# Altium project NANORACK_LASER.PrjPcb
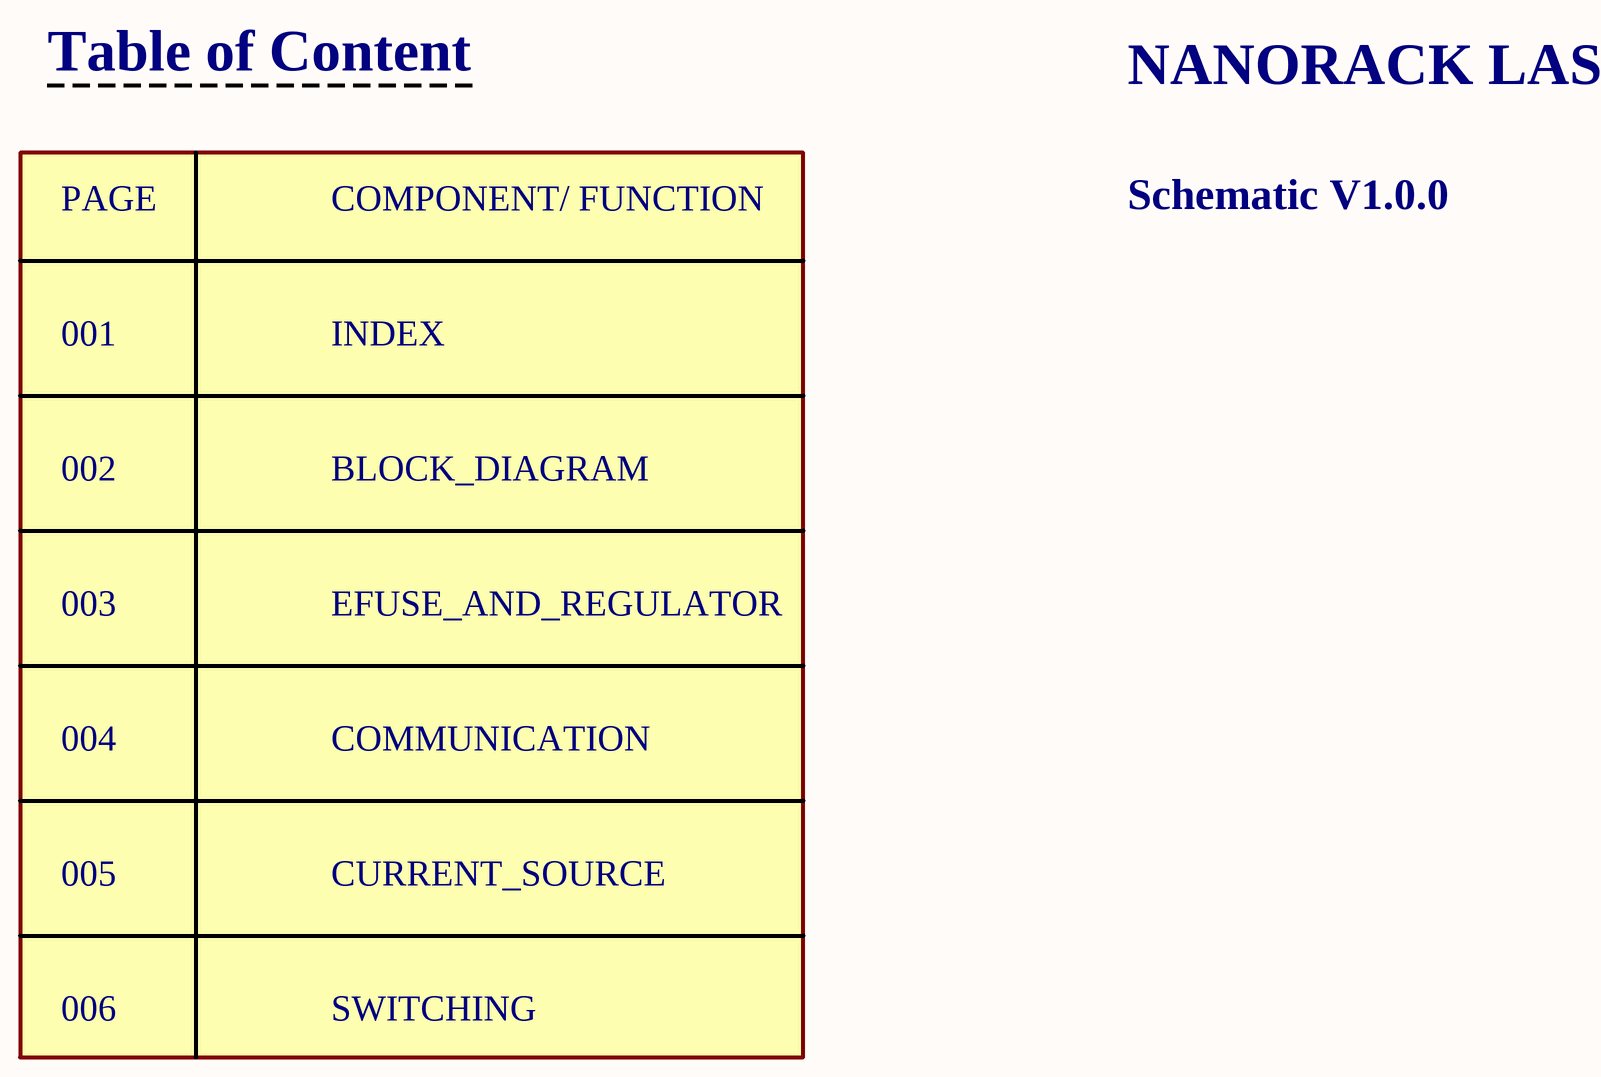
[diagram p0: INDEX.SchDoc]
7 sheets, 598 parts. Net scope: global (net labels, ports and power ports of the same name join across sheets).
Board file: LASERDIODE_FIX.PcbDoc
Sheets:
  INDEX.SchDoc
  BLOCK_DIAGRAM.SchDoc
  EFUSE_AND_REGULATOR.SchDoc
  COMMUNICATION.SchDoc
  CURRENT_SOURCE.SchDoc
  SWITCHING.SchDoc
  SWITCHING (CONT).SchDoc

## Sheet INDEX.SchDoc
size 420 x 297 mm; SheetNumber: 1; SheetTotal: 6

### Notes on the sheet
- Table of Content
- NANORACK LASER
- PAGE
- COMPONENT/ FUNCTION
- Schematic V1.0.0
- 001
- INDEX
- 002
- BLOCK_DIAGRAM
- 003
- EFUSE_AND_REGULATOR
- 004
- COMMUNICATION
- 005
- CURRENT_SOURCE
- 006
- SWITCHING
- Project:
- BEE-PC1
- Sub-system:
- Design by:
- Hung Nguyen D.
- Bao Bui Q.
- Sheet title:
- Sheet
- A3
- of
- Checked by:
- Approved by:
- Vu Pham
- Revision:
- Document No:
- V1.0.0
- Size:
- Date:

## Sheet BLOCK_DIAGRAM.SchDoc
size 420 x 297 mm; SheetNumber: 2; SheetTotal: 6

### Notes on the sheet
- Project:
- BEE-PC1
- Sub-system:
- Design by:
- Hung Nguyen D.
- Bao Bui Q.
- Sheet title:
- Sheet
- A3
- of
- Checked by:
- Approved by:
- Vu Pham
- Revision:
- Document No:
- V1.0.0
- Size:
- Date:
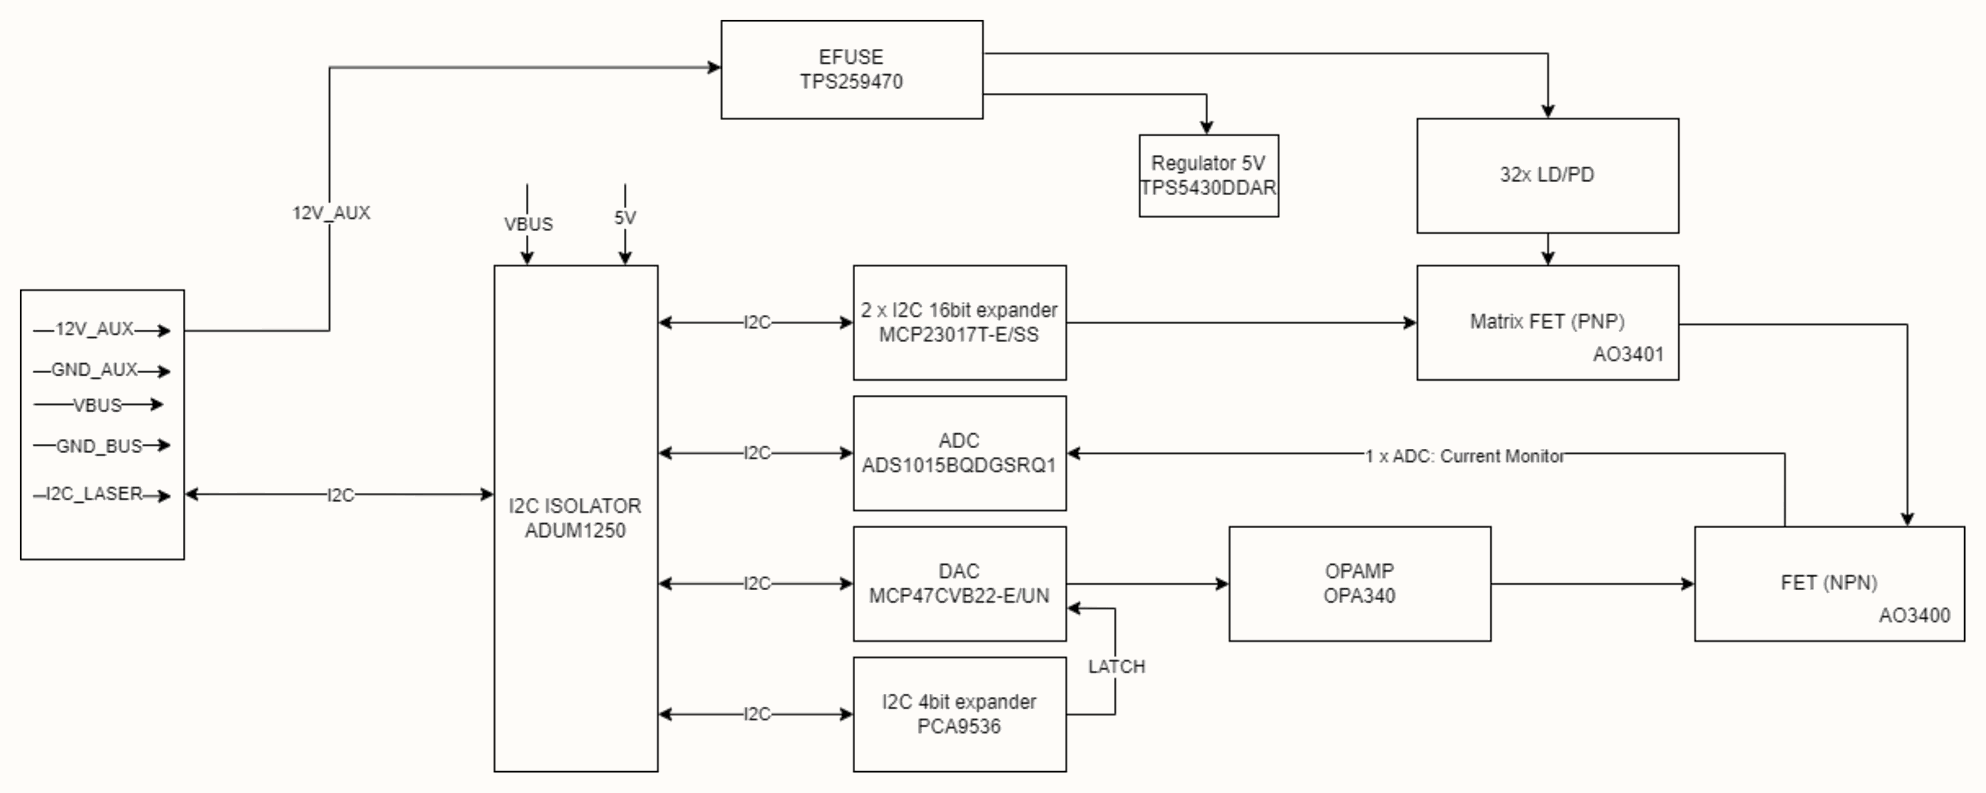
[diagram p1: BLOCK_DIAGRAM.SchDoc]

## Sheet EFUSE_AND_REGULATOR.SchDoc
size 420 x 297 mm; SheetNumber: 3; SheetTotal: 6
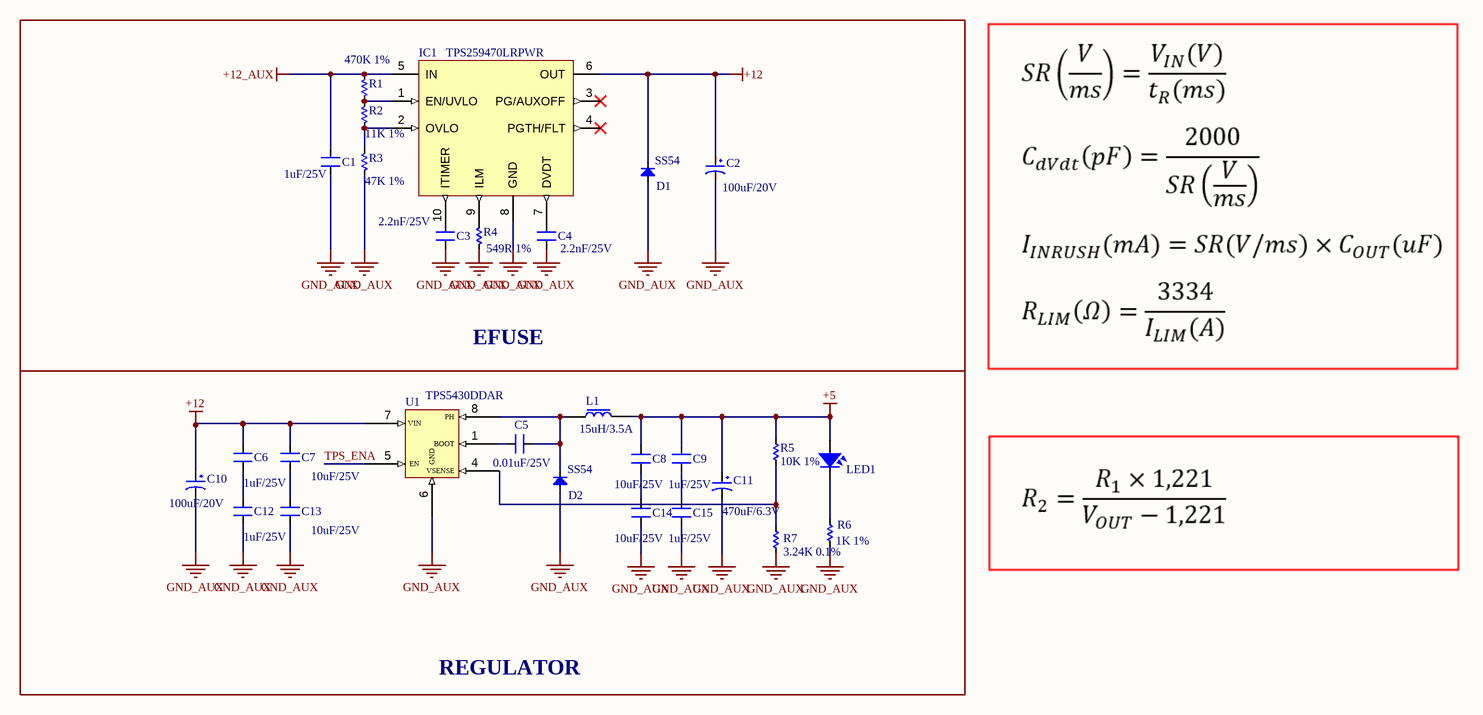
[diagram p2: EFUSE_AND_REGULATOR.SchDoc]

### Parts
C1  1uF/25V  [SM-0603]
C2  100uF/20V  [tu tantalum smd7343]
C3  2.2nF/25V  [SM-0603]
C4  2.2nF/25V  [SM-0603]
C5  0.01uF/25V  [SM-0603]
C6  1uF/25V  [SM-0603]
C7  10uF/25V  [SM-0603]
C8  10uF/25V  [SM-0603]
C9  1uF/25V  [SM-0603]
C10  100uF/20V  [tu tantalum smd7343]
C11  470uF/6.3V  [tu tantalum smd7343]
C12  1uF/25V  [SM-0603]
C13  10uF/25V  [SM-0603]
C14  10uF/25V  [SM-0603]
C15  1uF/25V  [SM-0603]
D1  SS54  [DIO-SMD-A]
D2  SS54  [DIO-SMD-A]
IC1  TPS259470LRPWR  [TPS259470]
L1  15uH/3.5A  [SRP7050TA]
LED1  LED  [REDLED_0603]  (value not drawn)
R1  470K 1%  [RES-SMD-0603]
R2  11K 1%  [RES-SMD-0603]
R3  47K 1%  [RES-SMD-0603]
R4  549R 1%  [RES-SMD-0603]
R5  10K 1%  [RES-SMD-0603]
R6  1K 1%  [RES-SMD-0603]
R7  3.24K 0.1%  [RES-SMD-0603]
U1  TPS5430DDAR  [HSOP8]

### Blocks framed on the sheet
EFUSE: C1-C4 D1 IC1 R1-R4
REGULATOR: C5-C15 D2 L1 LED1 R5-R7 U1

### Nets
+5: C8.1 C9.1 C11.1 L1.2 LED1.1 R5.2
+12: C2.1 C6.1 C7.1 C10.1 D1.2(K) IC1.6(OUT) U1.7(VIN)
+12_AUX: C1.2 IC1.5(IN) R1.2
GND_AUX: C1.1 C2.2 C3.1 C4.1 C10.2 C11.2 C12.2 C13.2 C14.2 C15.2 D1.1(A) D2.1(A) IC1.8(GND) R3.1 R4.1 R6.2 R7.1 U1.6(GND)
TPS_ENA: U1.5(EN)
NetC3_2: C3.2 IC1.10(ITIMER)
NetC4_2: C4.2 IC1.7(DVDT)
NetC5_1: C5.1 D2.2(K) L1.1 U1.8(PH)
NetC5_2: C5.2 U1.1(BOOT)
NetC6_2: C6.2 C12.1
NetC7_2: C7.2 C13.1
NetC8_2: C8.2 C14.1
NetC9_2: C9.2 C15.1
NetIC1_1: IC1.1(EN/UVLO) R1.1 R2.2
NetIC1_2: IC1.2(OVLO) R2.1 R3.2
NetIC1_9: IC1.9(ILM) R4.2
NetLED1_2: LED1.2 R6.1
NetR5_1: R5.1 R7.2 U1.4(VSENSE)

Not connected (* = marked no-connect by the designer): IC1 3(PG/AUXOFF)* 4(PGTH/FLT)*

### Notes on the sheet
- Project:
- BEE-PC1
- Sub-system:
- Design by:
- Hung Nguyen D.
- Bao Bui Q.
- Sheet title:
- Sheet
- A3
- of
- Checked by:
- Approved by:
- Vu Pham
- Revision:
- Document No:
- V1.0.0
- Size:
- Date:

### Library data of the parts
C1 C3-C9 C12-C15 = CM: 0603; Value: 103
C2 C10 = Tu tantalum 100uF 25V SMD7343: TAJD107K020RNJ; Chung_Loai: Dán; Don_Vi: Con; So_Chan: 2; Ten_Linh_Kien: Tụ tantalum 107E-100uF 25V SMD7343; Ma_Hang: MH002347; Kieu_Chan: *
C11 = Tu tantalum 100uF 25V SMD7343: TAJD477K006RNJ; Chung_Loai: Dán; Don_Vi: Con; So_Chan: 2; Ten_Linh_Kien: Tụ tantalum 107E-100uF 25V SMD7343; Ma_Hang: MH002347; Kieu_Chan: *
D1 D2 = Diode SMD: DIODE SCHOTTKY 40V 5A SMA; Code - JEDEC: DO-214-AB; Value: 1N5007; Published: 8-Jun-2000; Revision: July-2002: Re-released for DXP Platform.; Publisher: Altium Limited
IC1 = TPS259470: P/N: TPS259470LRPWR
L1 = INDUCTOR: SRP7050TA-150M
LED1 = LED SMD: Value: LED 3 - 5 ly 2 Colour
R1-R6 = Res-SMD: 0603; Manufacturer: Generic Components; Class: Passive; Published: 08/06/2000; Publisher: Altium Hobart Technology Centre
R7 = Res-SMD: ERA-3AEB3241V; Manufacturer: Generic Components; Class: Passive; Published: 08/06/2000; Publisher: Altium Hobart Technology Centre
U1 = TPS543X: 8SOP; pin to pad: 6>6+9

## Sheet COMMUNICATION.SchDoc
size 420 x 297 mm; SheetNumber: 4; SheetTotal: 7
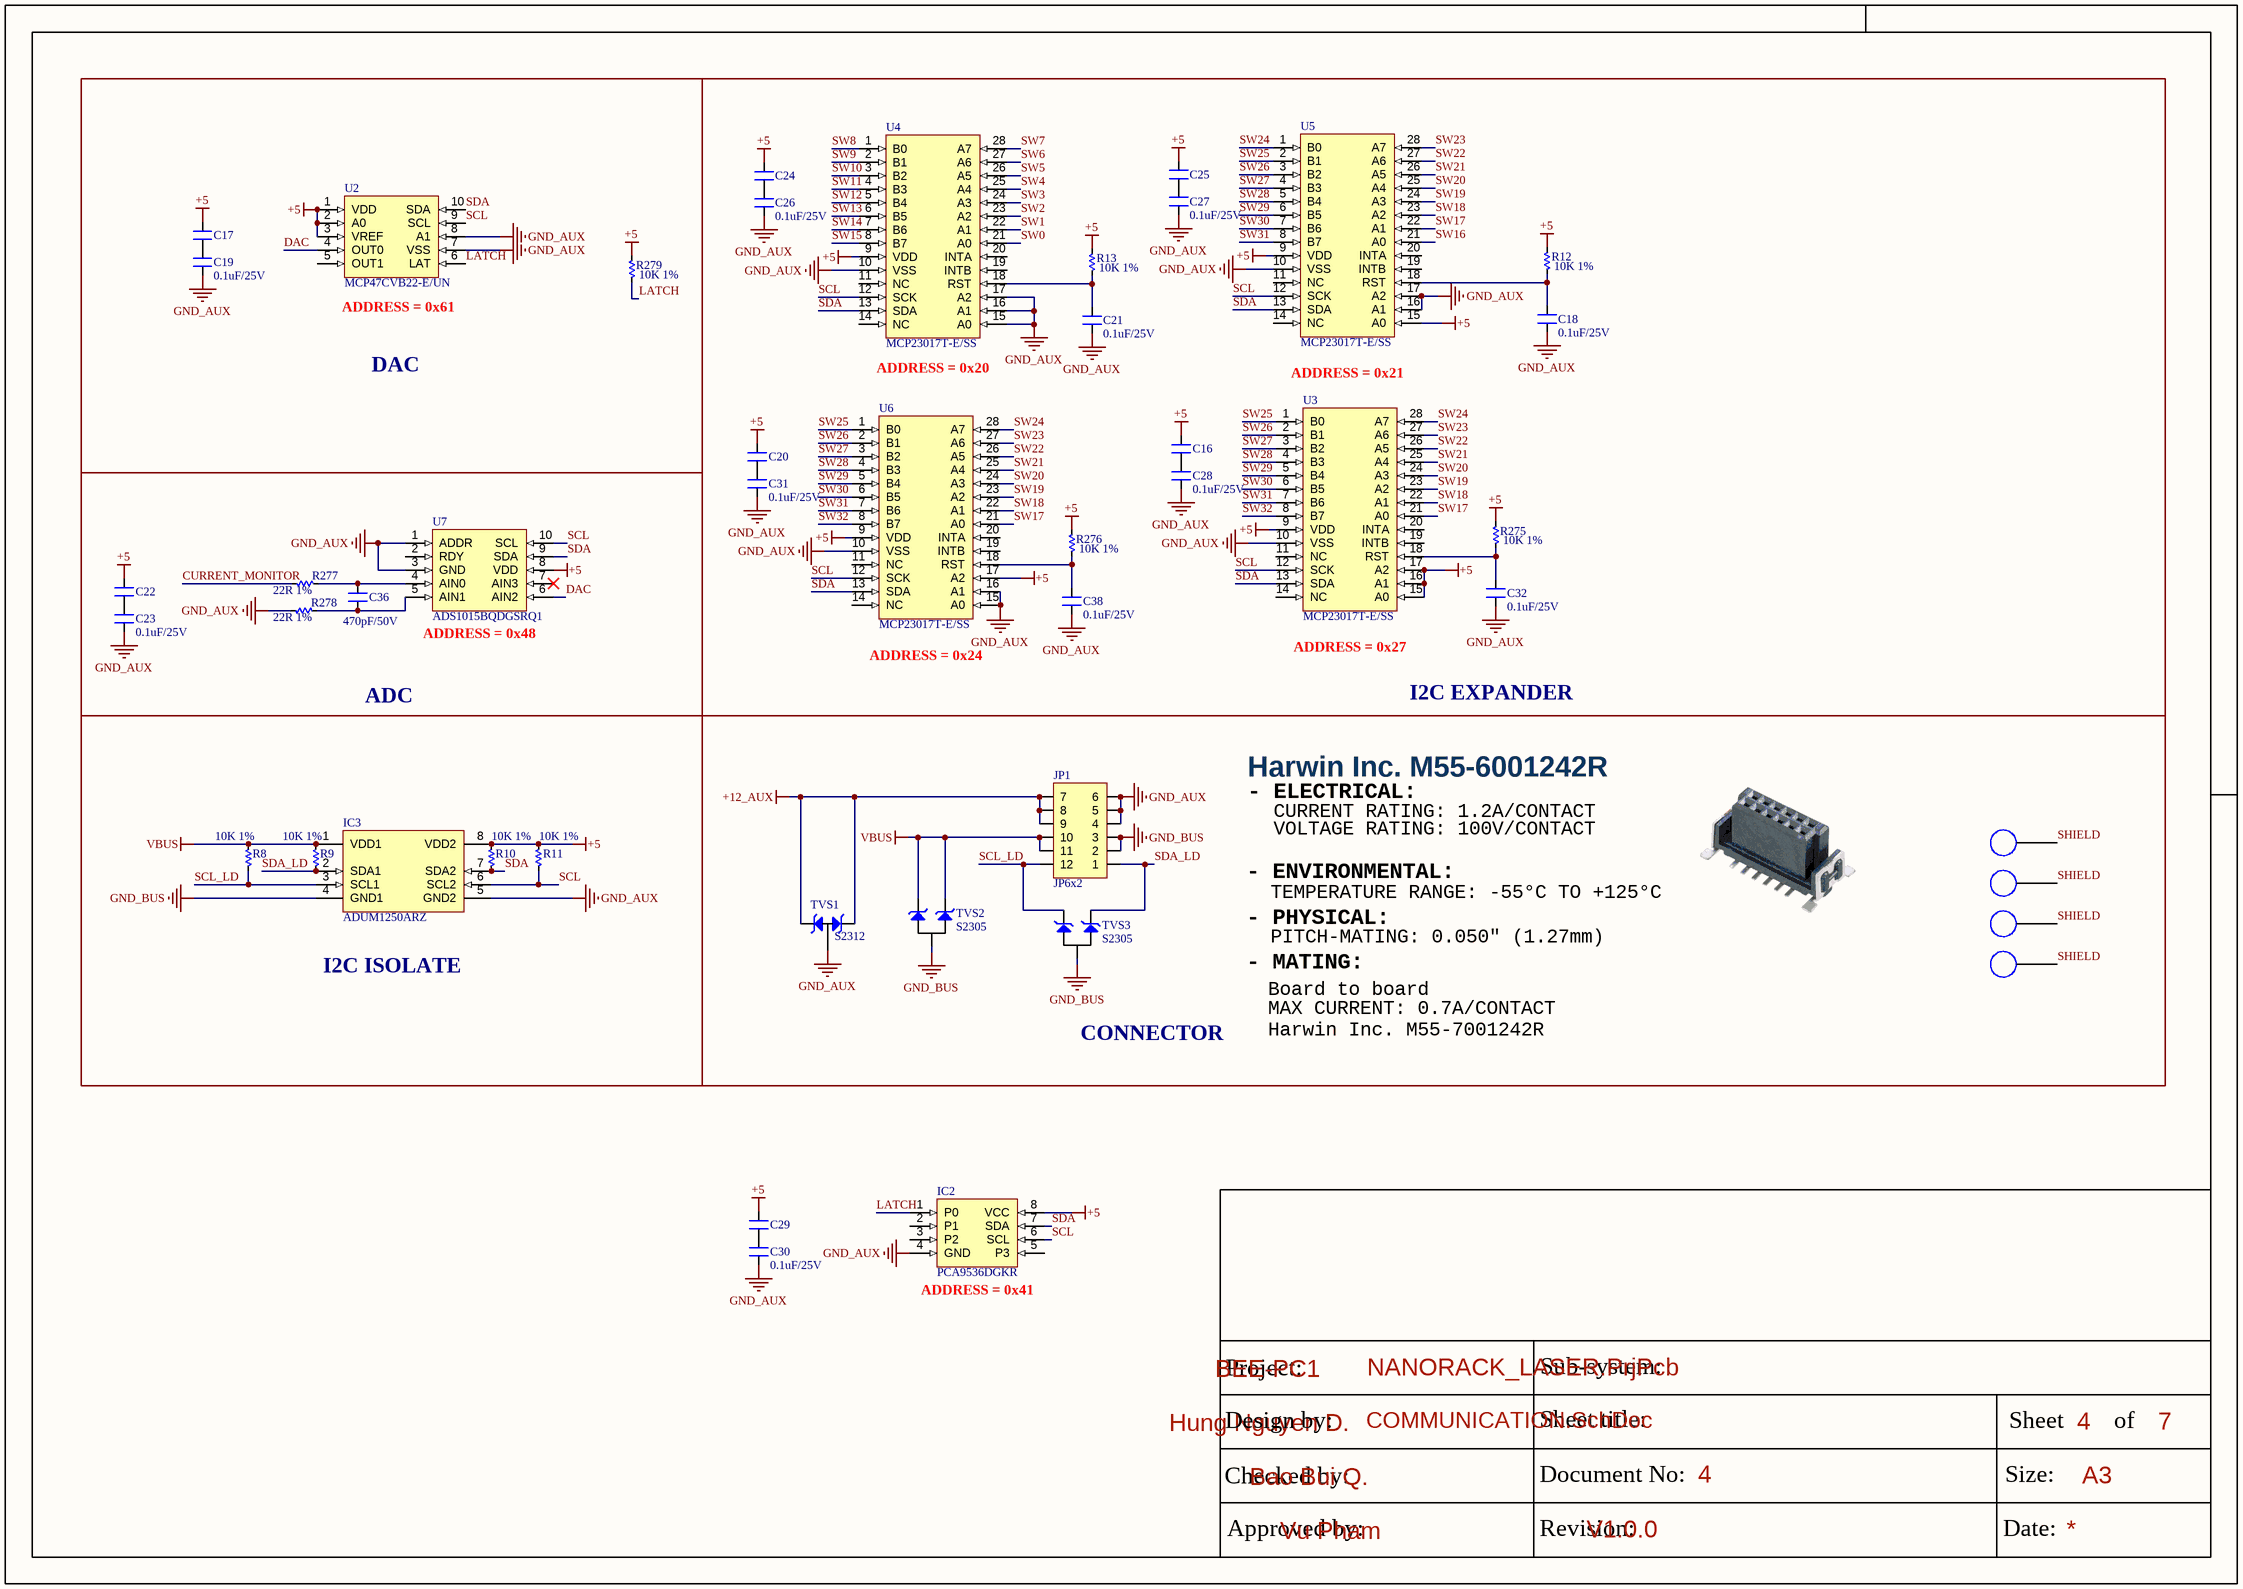
[diagram p3: COMMUNICATION.SchDoc]

### Parts
C16  0.1uF/25V  [SM-0603]  (value not drawn)
C17  0.1uF/25V  [SM-0603]  (value not drawn)
C18  0.1uF/25V  [SM-0603]
C19  0.1uF/25V  [SM-0603]
C20  0.1uF/25V  [SM-0603]  (value not drawn)
C21  0.1uF/25V  [SM-0603]
C22  0.1uF/25V  [SM-0603]  (value not drawn)
C23  0.1uF/25V  [SM-0603]
C24  0.1uF/25V  [SM-0603]  (value not drawn)
C25  0.1uF/25V  [SM-0603]  (value not drawn)
C26  0.1uF/25V  [SM-0603]
C27  0.1uF/25V  [SM-0603]
C28  0.1uF/25V  [SM-0603]
C29  0.1uF/25V  [SM-0603]  (value not drawn)
C30  0.1uF/25V  [SM-0603]
C31  0.1uF/25V  [SM-0603]
C32  0.1uF/25V  [SM-0603]
C36  470pF/50V  [SM-0603]
C38  0.1uF/25V  [SM-0603]
H1  M3  [M3]  (value not drawn)
H2  M3  [M3]  (value not drawn)
H3  M3  [M3]  (value not drawn)
H4  M3  [M3]  (value not drawn)
IC2  PCA9536DGKR  [TSSOP8]
IC3  ADUM1250ARZ  [SO8]
JP1  JP6x2  [M55-6001242R]
R8  10K 1%  [RES-SMD-0603]
R9  10K 1%  [RES-SMD-0603]
R10  10K 1%  [RES-SMD-0603]
R11  10K 1%  [RES-SMD-0603]
R12  10K 1%  [RES-SMD-0603]
R13  10K 1%  [RES-SMD-0603]
R275  10K 1%  [RES-SMD-0603]
R276  10K 1%  [RES-SMD-0603]
R277  22R 1%  [RES-SMD-0603]
R278  22R 1%  [RES-SMD-0603]
R279  10K 1%  [RES-SMD-0603]
TVS1  S2312  [SOT23-123]
TVS2  S2305  [SOT23-123]
TVS3  S2305  [SOT23-123]
U2  MCP47CVB22-E/UN  [MSOP10]
U3  MCP23017T-E/SS  [SSOP28]
U4  MCP23017T-E/SS  [SSOP28]
U5  MCP23017T-E/SS  [SSOP28]
U6  MCP23017T-E/SS  [SSOP28]
U7  ADS1015BQDGSRQ1  [VSSOP10]

### Blocks framed on the sheet
DAC: C17 C19 R279 U2
I2C EXPANDER: C16 C18 C20 C21 C24-C28 C31 C32 C38 R12 R13 R275 R276 U3-U6
ADC: C22 C23 C36 R277 R278 U7
I2C ISOLATE: IC3 R8-R11
Harwin Inc. M55-6001242R: H1-H4 JP1 TVS1-TVS3

### Nets
+5: C16.2 C17.2 C20.2 C22.2 C24.2 C25.2 C29.2 IC2.8(VCC) IC3.8(VDD2) R10.2 R11.2 R12.2 R13.2 R275.2 R276.2 R279.2 U2.1(VDD) U2.2(A0) U2.3(VREF) U3.9(VDD) U3.15(A0) U3.16(A1) U3.17(A2) U4.9(VDD) U5.9(VDD) U5.15(A0) U6.9(VDD) U6.17(A2) U7.8(VDD)
+12_AUX: JP1.7 JP1.8 JP1.9 TVS1.1 TVS1.3
GND_AUX: C18.1 C19.1 C21.1 C23.1 C26.1 C27.1 C28.1 C30.1 C31.1 C32.1 C38.1 IC2.4(GND) IC3.5(GND2) JP1.4 JP1.5 JP1.6 R278.2 TVS1.2 U2.7(VSS) U2.8(A1) U3.10(VSS) U4.10(VSS) U4.15(A0) U4.16(A1) U4.17(A2) U5.10(VSS) U5.16(A1) U5.17(A2) U6.10(VSS) U6.15(A0) U6.16(A1) U7.1(ADDR) U7.3(GND)
GND_BUS: IC3.4(GND1) JP1.2 JP1.3 TVS2.2 TVS3.2
VBUS: IC3.1(VDD1) JP1.10 JP1.11 R8.2 R9.2 TVS2.1 TVS2.3
CURRENT_MONITOR: R277.2
DAC: U2.4(OUT0) U7.6(AIN2)
LATCH: IC2.1(P0) R279.1 U2.6(LAT)
SCL: IC2.6(SCL) IC3.6(SCL2) R11.1 U2.9(SCL) U3.12(SCK) U4.12(SCK) U5.12(SCK) U6.12(SCK) U7.10(SCL)
SCL_LD: IC3.3(SCL1) JP1.12 R8.1 TVS3.3
SDA: IC2.7(SDA) IC3.7(SDA2) R10.1 U2.10(SDA) U3.13(SDA) U4.13(SDA) U5.13(SDA) U6.13(SDA) U7.9(SDA)
SDA_LD: IC3.2(SDA1) JP1.1 R9.1 TVS3.1
SHIELD: H1.1 H2.1 H3.1 H4.1
SW0: U4.21(A0)
SW1: U4.22(A1)
SW2: U4.23(A2)
SW3: U4.24(A3)
SW4: U4.25(A4)
SW5: U4.26(A5)
SW6: U4.27(A6)
SW7: U4.28(A7)
SW8: U4.1(B0)
SW9: U4.2(B1)
SW10: U4.3(B2)
SW11: U4.4(B3)
SW12: U4.5(B4)
SW13: U4.6(B5)
SW14: U4.7(B6)
SW15: U4.8(B7)
SW16: U5.21(A0)
SW17: U3.21(A0) U5.22(A1) U6.21(A0)
SW18: U3.22(A1) U5.23(A2) U6.22(A1)
SW19: U3.23(A2) U5.24(A3) U6.23(A2)
SW20: U3.24(A3) U5.25(A4) U6.24(A3)
SW21: U3.25(A4) U5.26(A5) U6.25(A4)
SW22: U3.26(A5) U5.27(A6) U6.26(A5)
SW23: U3.27(A6) U5.28(A7) U6.27(A6)
SW24: U3.28(A7) U5.1(B0) U6.28(A7)
SW25: U3.1(B0) U5.2(B1) U6.1(B0)
SW26: U3.2(B1) U5.3(B2) U6.2(B1)
SW27: U3.3(B2) U5.4(B3) U6.3(B2)
SW28: U3.4(B3) U5.5(B4) U6.4(B3)
SW29: U3.5(B4) U5.6(B5) U6.5(B4)
SW30: U3.6(B5) U5.7(B6) U6.6(B5)
SW31: U3.7(B6) U5.8(B7) U6.7(B6)
SW32: U3.8(B7) U6.8(B7)
NetC16_1: C16.1 C28.2
NetC17_1: C17.1 C19.2
NetC18_2: C18.2 R12.1 U5.18(RST)
NetC20_1: C20.1 C31.2
NetC21_2: C21.2 R13.1 U4.18(RST)
NetC22_1: C22.1 C23.2
NetC24_1: C24.1 C26.2
NetC25_1: C25.1 C27.2
NetC29_1: C29.1 C30.2
NetC32_2: C32.2 R275.1 U3.18(RST)
NetC36_1: C36.1 R278.1 U7.5(AIN1)
NetC36_2: C36.2 R277.1 U7.4(AIN0)
NetC38_2: C38.2 R276.1 U6.18(RST)

Not connected (* = marked no-connect by the designer): IC2 2(P1) 3(P2) 5(P3); U2 5(OUT1); U3 11(NC) 14(NC) 19(INTB) 20(INTA); U4 11(NC) 14(NC) 19(INTB) 20(INTA); U5 11(NC) 14(NC) 19(INTB) 20(INTA); U6 11(NC) 14(NC) 19(INTB) 20(INTA); U7 2(RDY) 7(AIN3)*

### Notes on the sheet
- (near U2) ADDRESS = 0x61
- ADDRESS = 0x20
- ADDRESS = 0x21
- (near U7) ADDRESS = 0x48
- (near U6) ADDRESS = 0x24
- (near U3) ADDRESS = 0x27
- - ELECTRICAL:
- CURRENT RATING: 1.2A/CONTACT
- VOLTAGE RATING: 100V/CONTACT
- - ENVIRONMENTAL:
- - PHYSICAL:
- TEMPERATURE RANGE: -55°C TO +125°C
- - MATING:
- Board to board
- PITCH-MATING: 0.050" (1.27mm)
- CONNECTOR
- MAX CURRENT: 0.7A/CONTACT
- Harwin Inc. M55-7001242R
- (near IC2) ADDRESS = 0x41
- Project:
- BEE-PC1
- Sub-system:
- Design by:
- Hung Nguyen D.
- Bao Bui Q.
- Sheet title:
- Sheet
- A3
- of
- Checked by:
- Approved by:
- Vu Pham
- Revision:
- Document No:
- V1.0.0
- Size:
- Date:

### Library data of the parts
C16-C32 C36 C38 = CM: 0603; Value: 103
IC2 = PCA9536
IC3 = ADUM1250
JP1 = JP6x2: WR-PHD 2.54 mm Dual Socket Header; Manufacturer: W¨¹rth Elektronik eiSos GmbH; partNo: 61301221821; ComponentLink1 Description: Manufacturer; ComponentLink2 Description: Datasheet; NoPins: 12; Created Date: 29 March 2013; ComponentLink1URL: http://www.we-online.com; ComponentLink2URL: http://katalog.we-online.de/em/datasheet/6130xx21821.pdf; Created by: Karrer Zheng
R8-R13 R275-R279 = Res-SMD: as R1 on sheet EFUSE_AND_REGULATOR; Published: 08/06/2000; Publisher: Altium Hobart Technology Centre
TVS1 = S2315: TVS DIODE 12VWM 19VC SOT23, P/N:  S2312
TVS2 TVS3 = S2303: TVS DIODE 5VWM 10.8VC SOT23, P/N: / S2305
U2 = MCP47CVB22
U3-U6 = MCP23017
U7 = ADS1015

## Sheet CURRENT_SOURCE.SchDoc
size 420 x 297 mm; SheetNumber: 5; SheetTotal: 7
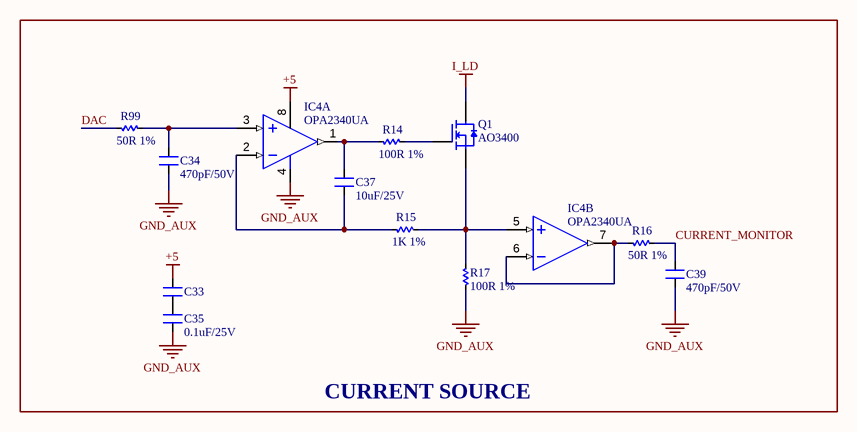
[diagram p4: CURRENT_SOURCE.SchDoc]

### Parts
C33  0.1uF/25V  [SM-0603]  (value not drawn)
C34  470pF/50V  [SM-0603]
C35  0.1uF/25V  [SM-0603]
C37  10uF/25V  [SM-0603]
C39  470pF/50V  [SM-0603]
IC4  OPA2340UA  [SO8]  (parts A,B of 2)
Q1  AO3400  [SOT23-132]
R14  100R 1%  [RES-SMD-0603]
R15  1K 1%  [RES-SMD-0603]
R16  50R 1%  [RES-SMD-0603]
R17  100R 1%  [RES-SMD-0603]
R99  50R 1%  [RES-SMD-0603]

### Blocks framed on the sheet
CURRENT SOURCE: C33-C35 C37 C39 IC4 Q1 R14-R17 R99

### Nets
+5: C33.2 IC4.8(+V)
GND_AUX: C34.1 C35.1 C39.1 IC4.4(-V) R17.1
I_LD: Q1.3
CURRENT_MONITOR: C39.2 R16.2
DAC: R99.1
NetC33_1: C33.1 C35.2
NetC34_2: C34.2 IC4.3(IN+) R99.2
NetC37_1: C37.1 IC4.2(IN-) R15.1
NetC37_2: C37.2 IC4.1(OUT) R14.1
NetIC4_5: IC4.5(IN+) Q1.2 R15.2 R17.2
NetIC4_6: IC4.6(IN-) IC4.7(OUT) R16.1
NetQ1_1: Q1.1 R14.2

### Notes on the sheet
- Project:
- BEE-PC1
- Sub-system:
- Design by:
- Hung Nguyen D.
- Bao Bui Q.
- Sheet title:
- Sheet
- A3
- of
- Checked by:
- Approved by:
- Vu Pham
- Revision:
- Document No:
- V1.0.0
- Size:
- Date:

### Library data of the parts
C33-C35 C37 C39 = CM: 0603; Value: 103
IC4 = LM358: 8SOIC; Value: LM358
Q1 = FET-N
R14-R17 R99 = Res-SMD: as R1 on sheet EFUSE_AND_REGULATOR; Published: 08/06/2000; Publisher: Altium Hobart Technology Centre

## Sheet SWITCHING.SchDoc
size 420 x 297 mm; SheetNumber: 6; SheetTotal: 6
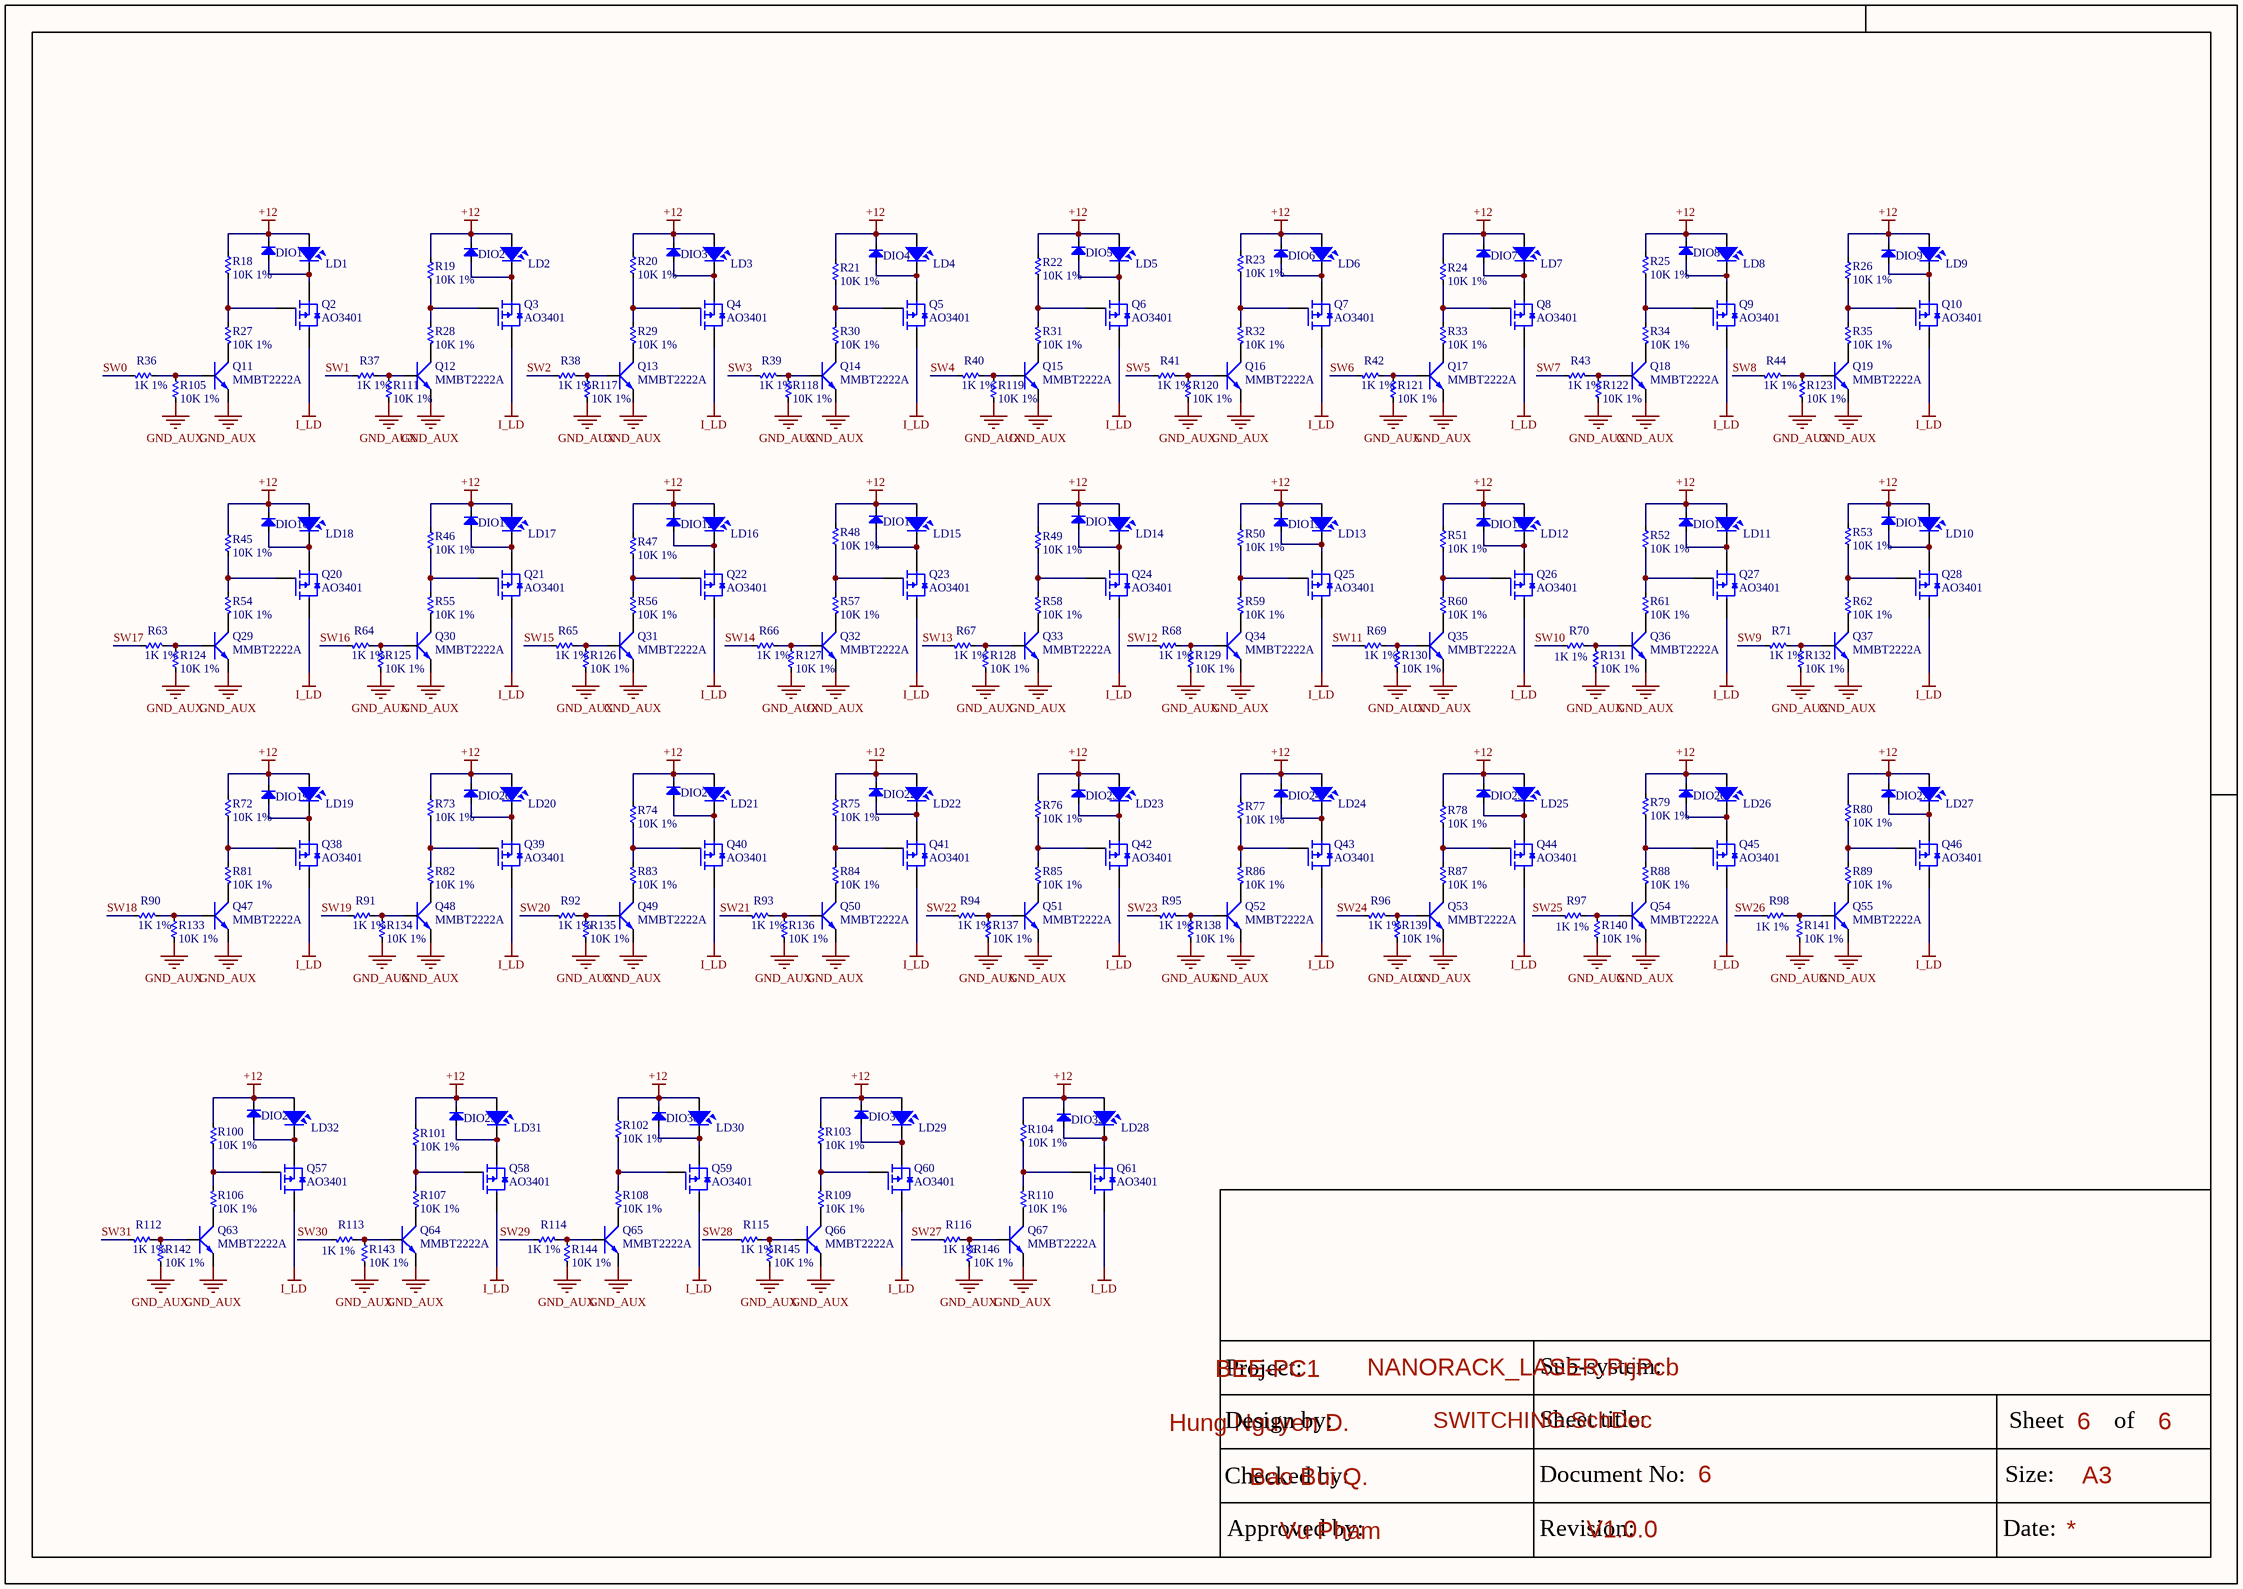
[diagram p5: SWITCHING.SchDoc]

### Parts
DIO1  Diode SMD  [SOD23]  (value not drawn)
DIO2  Diode SMD  [SOD23]  (value not drawn)
DIO3  Diode SMD  [SOD23]  (value not drawn)
DIO4  Diode SMD  [SOD23]  (value not drawn)
DIO5  Diode SMD  [SOD23]  (value not drawn)
DIO6  Diode SMD  [SOD23]  (value not drawn)
DIO7  Diode SMD  [SOD23]  (value not drawn)
DIO8  Diode SMD  [SOD23]  (value not drawn)
DIO9  Diode SMD  [SOD23]  (value not drawn)
DIO10  Diode SMD  [SOD23]  (value not drawn)
DIO11  Diode SMD  [SOD23]  (value not drawn)
DIO12  Diode SMD  [SOD23]  (value not drawn)
DIO13  Diode SMD  [SOD23]  (value not drawn)
DIO14  Diode SMD  [SOD23]  (value not drawn)
DIO15  Diode SMD  [SOD23]  (value not drawn)
DIO16  Diode SMD  [SOD23]  (value not drawn)
DIO17  Diode SMD  [SOD23]  (value not drawn)
DIO18  Diode SMD  [SOD23]  (value not drawn)
DIO19  Diode SMD  [SOD23]  (value not drawn)
DIO20  Diode SMD  [SOD23]  (value not drawn)
DIO21  Diode SMD  [SOD23]  (value not drawn)
DIO22  Diode SMD  [SOD23]  (value not drawn)
DIO23  Diode SMD  [SOD23]  (value not drawn)
DIO24  Diode SMD  [SOD23]  (value not drawn)
DIO25  Diode SMD  [SOD23]  (value not drawn)
DIO26  Diode SMD  [SOD23]  (value not drawn)
DIO27  Diode SMD  [SOD23]  (value not drawn)
DIO28  Diode SMD  [SOD23]  (value not drawn)
DIO29  Diode SMD  [SOD23]  (value not drawn)
DIO30  Diode SMD  [SOD23]  (value not drawn)
DIO31  Diode SMD  [SOD23]  (value not drawn)
DIO32  Diode SMD  [SOD23]  (value not drawn)
LD1  LaserDiode  [LASER]  (value not drawn)
LD2  LaserDiode  [LASER]  (value not drawn)
LD3  LaserDiode  [LASER]  (value not drawn)
LD4  LaserDiode  [LASER]  (value not drawn)
LD5  LaserDiode  [LASER]  (value not drawn)
LD6  LaserDiode  [LASER]  (value not drawn)
LD7  LaserDiode  [LASER]  (value not drawn)
LD8  LaserDiode  [LASER]  (value not drawn)
LD9  LaserDiode  [LASER]  (value not drawn)
LD10  LaserDiode  [LASER]  (value not drawn)
LD11  LaserDiode  [LASER]  (value not drawn)
LD12  LaserDiode  [LASER]  (value not drawn)
LD13  LaserDiode  [LASER]  (value not drawn)
LD14  LaserDiode  [LASER]  (value not drawn)
LD15  LaserDiode  [LASER]  (value not drawn)
LD16  LaserDiode  [LASER]  (value not drawn)
LD17  LaserDiode  [LASER]  (value not drawn)
LD18  LaserDiode  [LASER]  (value not drawn)
LD19  LaserDiode  [LASER]  (value not drawn)
LD20  LaserDiode  [LASER]  (value not drawn)
LD21  LaserDiode  [LASER]  (value not drawn)
LD22  LaserDiode  [LASER]  (value not drawn)
LD23  LaserDiode  [LASER]  (value not drawn)
LD24  LaserDiode  [LASER]  (value not drawn)
LD25  LaserDiode  [LASER]  (value not drawn)
LD26  LaserDiode  [LASER]  (value not drawn)
LD27  LaserDiode  [LASER]  (value not drawn)
LD28  LaserDiode  [LASER]  (value not drawn)
LD29  LaserDiode  [LASER]  (value not drawn)
LD30  LaserDiode  [LASER]  (value not drawn)
LD31  LaserDiode  [LASER]  (value not drawn)
LD32  LaserDiode  [LASER]  (value not drawn)
Q2  AO3401  [SOT23-123]
Q3  AO3401  [SOT23-123]
Q4  AO3401  [SOT23-123]
Q5  AO3401  [SOT23-123]
Q6  AO3401  [SOT23-123]
Q7  AO3401  [SOT23-123]
Q8  AO3401  [SOT23-123]
Q9  AO3401  [SOT23-123]
Q10  AO3401  [SOT23-123]
Q11  MMBT2222A  [SOT23-132]
Q12  MMBT2222A  [SOT23-132]
Q13  MMBT2222A  [SOT23-132]
Q14  MMBT2222A  [SOT23-132]
Q15  MMBT2222A  [SOT23-132]
Q16  MMBT2222A  [SOT23-132]
Q17  MMBT2222A  [SOT23-132]
Q18  MMBT2222A  [SOT23-132]
Q19  MMBT2222A  [SOT23-132]
Q20  AO3401  [SOT23-123]
Q21  AO3401  [SOT23-123]
Q22  AO3401  [SOT23-123]
Q23  AO3401  [SOT23-123]
Q24  AO3401  [SOT23-123]
Q25  AO3401  [SOT23-123]
Q26  AO3401  [SOT23-123]
Q27  AO3401  [SOT23-123]
Q28  AO3401  [SOT23-123]
Q29  MMBT2222A  [SOT23-132]
Q30  MMBT2222A  [SOT23-132]
Q31  MMBT2222A  [SOT23-132]
Q32  MMBT2222A  [SOT23-132]
Q33  MMBT2222A  [SOT23-132]
Q34  MMBT2222A  [SOT23-132]
Q35  MMBT2222A  [SOT23-132]
Q36  MMBT2222A  [SOT23-132]
Q37  MMBT2222A  [SOT23-132]
Q38  AO3401  [SOT23-123]
Q39  AO3401  [SOT23-123]
Q40  AO3401  [SOT23-123]
Q41  AO3401  [SOT23-123]
Q42  AO3401  [SOT23-123]
Q43  AO3401  [SOT23-123]
Q44  AO3401  [SOT23-123]
Q45  AO3401  [SOT23-123]
Q46  AO3401  [SOT23-123]
Q47  MMBT2222A  [SOT23-132]
Q48  MMBT2222A  [SOT23-132]
Q49  MMBT2222A  [SOT23-132]
Q50  MMBT2222A  [SOT23-132]
Q51  MMBT2222A  [SOT23-132]
Q52  MMBT2222A  [SOT23-132]
Q53  MMBT2222A  [SOT23-132]
Q54  MMBT2222A  [SOT23-132]
Q55  MMBT2222A  [SOT23-132]
Q57  AO3401  [SOT23-123]
Q58  AO3401  [SOT23-123]
Q59  AO3401  [SOT23-123]
Q60  AO3401  [SOT23-123]
Q61  AO3401  [SOT23-123]
Q63  MMBT2222A  [SOT23-132]
Q64  MMBT2222A  [SOT23-132]
Q65  MMBT2222A  [SOT23-132]
Q66  MMBT2222A  [SOT23-132]
Q67  MMBT2222A  [SOT23-132]
R18  10K 1%  [RES-SMD-0603]
R19  10K 1%  [RES-SMD-0603]
R20  10K 1%  [RES-SMD-0603]
R21  10K 1%  [RES-SMD-0603]
R22  10K 1%  [RES-SMD-0603]
R23  10K 1%  [RES-SMD-0603]
R24  10K 1%  [RES-SMD-0603]
R25  10K 1%  [RES-SMD-0603]
R26  10K 1%  [RES-SMD-0603]
R27  10K 1%  [RES-SMD-0603]
R28  10K 1%  [RES-SMD-0603]
R29  10K 1%  [RES-SMD-0603]
R30  10K 1%  [RES-SMD-0603]
R31  10K 1%  [RES-SMD-0603]
R32  10K 1%  [RES-SMD-0603]
R33  10K 1%  [RES-SMD-0603]
R34  10K 1%  [RES-SMD-0603]
R35  10K 1%  [RES-SMD-0603]
R36  1K 1%  [RES-SMD-0603]
R37  1K 1%  [RES-SMD-0603]
R38  1K 1%  [RES-SMD-0603]
R39  1K 1%  [RES-SMD-0603]
R40  1K 1%  [RES-SMD-0603]
R41  1K 1%  [RES-SMD-0603]
R42  1K 1%  [RES-SMD-0603]
R43  1K 1%  [RES-SMD-0603]
R44  1K 1%  [RES-SMD-0603]
R45  10K 1%  [RES-SMD-0603]
R46  10K 1%  [RES-SMD-0603]
R47  10K 1%  [RES-SMD-0603]
R48  10K 1%  [RES-SMD-0603]
R49  10K 1%  [RES-SMD-0603]
R50  10K 1%  [RES-SMD-0603]
R51  10K 1%  [RES-SMD-0603]
R52  10K 1%  [RES-SMD-0603]
R53  10K 1%  [RES-SMD-0603]
R54  10K 1%  [RES-SMD-0603]
R55  10K 1%  [RES-SMD-0603]
R56  10K 1%  [RES-SMD-0603]
R57  10K 1%  [RES-SMD-0603]
R58  10K 1%  [RES-SMD-0603]
R59  10K 1%  [RES-SMD-0603]
R60  10K 1%  [RES-SMD-0603]
R61  10K 1%  [RES-SMD-0603]
R62  10K 1%  [RES-SMD-0603]
R63  1K 1%  [RES-SMD-0603]
R64  1K 1%  [RES-SMD-0603]
R65  1K 1%  [RES-SMD-0603]
R66  1K 1%  [RES-SMD-0603]
R67  1K 1%  [RES-SMD-0603]
R68  1K 1%  [RES-SMD-0603]
R69  1K 1%  [RES-SMD-0603]
R70  1K 1%  [RES-SMD-0603]
R71  1K 1%  [RES-SMD-0603]
R72  10K 1%  [RES-SMD-0603]
R73  10K 1%  [RES-SMD-0603]
R74  10K 1%  [RES-SMD-0603]
R75  10K 1%  [RES-SMD-0603]
R76  10K 1%  [RES-SMD-0603]
R77  10K 1%  [RES-SMD-0603]
R78  10K 1%  [RES-SMD-0603]
R79  10K 1%  [RES-SMD-0603]
R80  10K 1%  [RES-SMD-0603]
R81  10K 1%  [RES-SMD-0603]
R82  10K 1%  [RES-SMD-0603]
R83  10K 1%  [RES-SMD-0603]
R84  10K 1%  [RES-SMD-0603]
R85  10K 1%  [RES-SMD-0603]
R86  10K 1%  [RES-SMD-0603]
R87  10K 1%  [RES-SMD-0603]
R88  10K 1%  [RES-SMD-0603]
R89  10K 1%  [RES-SMD-0603]
R90  1K 1%  [RES-SMD-0603]
R91  1K 1%  [RES-SMD-0603]
R92  1K 1%  [RES-SMD-0603]
R93  1K 1%  [RES-SMD-0603]
R94  1K 1%  [RES-SMD-0603]
R95  1K 1%  [RES-SMD-0603]
R96  1K 1%  [RES-SMD-0603]
R97  1K 1%  [RES-SMD-0603]
R98  1K 1%  [RES-SMD-0603]
R100  10K 1%  [RES-SMD-0603]
R101  10K 1%  [RES-SMD-0603]
R102  10K 1%  [RES-SMD-0603]
R103  10K 1%  [RES-SMD-0603]
R104  10K 1%  [RES-SMD-0603]
R105  10K 1%  [RES-SMD-0603]
R106  10K 1%  [RES-SMD-0603]
R107  10K 1%  [RES-SMD-0603]
R108  10K 1%  [RES-SMD-0603]
R109  10K 1%  [RES-SMD-0603]
R110  10K 1%  [RES-SMD-0603]
R111  10K 1%  [RES-SMD-0603]
R112  1K 1%  [RES-SMD-0603]
R113  1K 1%  [RES-SMD-0603]
R114  1K 1%  [RES-SMD-0603]
R115  1K 1%  [RES-SMD-0603]
R116  1K 1%  [RES-SMD-0603]
R117  10K 1%  [RES-SMD-0603]
R118  10K 1%  [RES-SMD-0603]
R119  10K 1%  [RES-SMD-0603]
R120  10K 1%  [RES-SMD-0603]
R121  10K 1%  [RES-SMD-0603]
R122  10K 1%  [RES-SMD-0603]
R123  10K 1%  [RES-SMD-0603]
R124  10K 1%  [RES-SMD-0603]
R125  10K 1%  [RES-SMD-0603]
R126  10K 1%  [RES-SMD-0603]
R127  10K 1%  [RES-SMD-0603]
R128  10K 1%  [RES-SMD-0603]
R129  10K 1%  [RES-SMD-0603]
R130  10K 1%  [RES-SMD-0603]
R131  10K 1%  [RES-SMD-0603]
R132  10K 1%  [RES-SMD-0603]
R133  10K 1%  [RES-SMD-0603]
R134  10K 1%  [RES-SMD-0603]
R135  10K 1%  [RES-SMD-0603]
R136  10K 1%  [RES-SMD-0603]
R137  10K 1%  [RES-SMD-0603]
R138  10K 1%  [RES-SMD-0603]
R139  10K 1%  [RES-SMD-0603]
R140  10K 1%  [RES-SMD-0603]
R141  10K 1%  [RES-SMD-0603]
R142  10K 1%  [RES-SMD-0603]
R143  10K 1%  [RES-SMD-0603]
R144  10K 1%  [RES-SMD-0603]
R145  10K 1%  [RES-SMD-0603]
R146  10K 1%  [RES-SMD-0603]

### Nets
+12: DIO1.2(K) DIO2.2(K) DIO3.2(K) DIO4.2(K) DIO5.2(K) DIO6.2(K) DIO7.2(K) DIO8.2(K) DIO9.2(K) DIO10.2(K) DIO11.2(K) DIO12.2(K) DIO13.2(K) DIO14.2(K) DIO15.2(K) DIO16.2(K) DIO17.2(K) DIO18.2(K) DIO19.2(K) DIO20.2(K) DIO21.2(K) DIO22.2(K) DIO23.2(K) DIO24.2(K) DIO25.2(K) DIO26.2(K) DIO27.2(K) DIO28.2(K) DIO29.2(K) DIO30.2(K) DIO31.2(K) DIO32.2(K) LD1.1 LD2.1 LD3.1 LD4.1 LD5.1 LD6.1 LD7.1 LD8.1 LD9.1 LD10.1 LD11.1 LD12.1 LD13.1 LD14.1 LD15.1 LD16.1 LD17.1 LD18.1 LD19.1 LD20.1 LD21.1 LD22.1 LD23.1 LD24.1 LD25.1 LD26.1 LD27.1 LD28.1 LD29.1 LD30.1 LD31.1 LD32.1 R18.1 R19.1 R20.1 R21.1 R22.1 R23.1 R24.1 R25.1 R26.1 R45.1 R46.1 R47.1 R48.1 R49.1 R50.1 R51.1 R52.1 R53.1 R72.1 R73.1 R74.1 R75.1 R76.1 R77.1 R78.1 R79.1 R80.1 R100.1 R101.1 R102.1 R103.1 R104.1
GND_AUX: Q11.2(E) Q12.2(E) Q13.2(E) Q14.2(E) Q15.2(E) Q16.2(E) Q17.2(E) Q18.2(E) Q19.2(E) Q29.2(E) Q30.2(E) Q31.2(E) Q32.2(E) Q33.2(E) Q34.2(E) Q35.2(E) Q36.2(E) Q37.2(E) Q47.2(E) Q48.2(E) Q49.2(E) Q50.2(E) Q51.2(E) Q52.2(E) Q53.2(E) Q54.2(E) Q55.2(E) Q63.2(E) Q64.2(E) Q65.2(E) Q66.2(E) Q67.2(E) R105.2 R111.2 R117.2 R118.2 R119.2 R120.2 R121.2 R122.2 R123.2 R124.2 R125.2 R126.2 R127.2 R128.2 R129.2 R130.2 R131.2 R132.2 R133.2 R134.2 R135.2 R136.2 R137.2 R138.2 R139.2 R140.2 R141.2 R142.2 R143.2 R144.2 R145.2 R146.2
I_LD: Q2.2 Q3.2 Q4.2 Q5.2 Q6.2 Q7.2 Q8.2 Q9.2 Q10.2 Q20.2 Q21.2 Q22.2 Q23.2 Q24.2 Q25.2 Q26.2 Q27.2 Q28.2 Q38.2 Q39.2 Q40.2 Q41.2 Q42.2 Q43.2 Q44.2 Q45.2 Q46.2 Q57.2 Q58.2 Q59.2 Q60.2 Q61.2
SW0: R36.1
SW1: R37.1
SW2: R38.1
SW3: R39.1
SW4: R40.1
SW5: R41.1
SW6: R42.1
SW7: R43.1
SW8: R44.1
SW9: R71.1
SW10: R70.1
SW11: R69.1
SW12: R68.1
SW13: R67.1
SW14: R66.1
SW15: R65.1
SW16: R64.1
SW17: R63.1
SW18: R90.1
SW19: R91.1
SW20: R92.1
SW21: R93.1
SW22: R94.1
SW23: R95.1
SW24: R96.1
SW25: R97.1
SW26: R98.1
SW27: R116.1
SW28: R115.1
SW29: R114.1
SW30: R113.1
SW31: R112.1
NetDIO1_1: DIO1.1(A) LD1.3 Q2.3
NetDIO2_1: DIO2.1(A) LD2.3 Q3.3
NetDIO3_1: DIO3.1(A) LD3.3 Q4.3
NetDIO4_1: DIO4.1(A) LD4.3 Q5.3
NetDIO5_1: DIO5.1(A) LD5.3 Q6.3
NetDIO6_1: DIO6.1(A) LD6.3 Q7.3
NetDIO7_1: DIO7.1(A) LD7.3 Q8.3
NetDIO8_1: DIO8.1(A) LD8.3 Q9.3
NetDIO9_1: DIO9.1(A) LD9.3 Q10.3
NetDIO10_1: DIO10.1(A) LD18.3 Q20.3
NetDIO11_1: DIO11.1(A) LD17.3 Q21.3
NetDIO12_1: DIO12.1(A) LD16.3 Q22.3
NetDIO13_1: DIO13.1(A) LD15.3 Q23.3
NetDIO14_1: DIO14.1(A) LD14.3 Q24.3
NetDIO15_1: DIO15.1(A) LD13.3 Q25.3
NetDIO16_1: DIO16.1(A) LD12.3 Q26.3
NetDIO17_1: DIO17.1(A) LD11.3 Q27.3
NetDIO18_1: DIO18.1(A) LD10.3 Q28.3
NetDIO19_1: DIO19.1(A) LD19.3 Q38.3
NetDIO20_1: DIO20.1(A) LD20.3 Q39.3
NetDIO21_1: DIO21.1(A) LD21.3 Q40.3
NetDIO22_1: DIO22.1(A) LD22.3 Q41.3
NetDIO23_1: DIO23.1(A) LD23.3 Q42.3
NetDIO24_1: DIO24.1(A) LD24.3 Q43.3
NetDIO25_1: DIO25.1(A) LD25.3 Q44.3
NetDIO26_1: DIO26.1(A) LD26.3 Q45.3
NetDIO27_1: DIO27.1(A) LD27.3 Q46.3
NetDIO28_1: DIO28.1(A) LD32.3 Q57.3
NetDIO29_1: DIO29.1(A) LD31.3 Q58.3
NetDIO30_1: DIO30.1(A) LD30.3 Q59.3
NetDIO31_1: DIO31.1(A) LD29.3 Q60.3
NetDIO32_1: DIO32.1(A) LD28.3 Q61.3
NetQ2_1: Q2.1 R18.2 R27.2
NetQ3_1: Q3.1 R19.2 R28.2
NetQ4_1: Q4.1 R20.2 R29.2
NetQ5_1: Q5.1 R21.2 R30.2
NetQ6_1: Q6.1 R22.2 R31.2
NetQ7_1: Q7.1 R23.2 R32.2
NetQ8_1: Q8.1 R24.2 R33.2
NetQ9_1: Q9.1 R25.2 R34.2
NetQ10_1: Q10.1 R26.2 R35.2
NetQ11_1: Q11.1(B) R36.2 R105.1
NetQ11_3: Q11.3(C) R27.1
NetQ12_1: Q12.1(B) R37.2 R111.1
NetQ12_3: Q12.3(C) R28.1
NetQ13_1: Q13.1(B) R38.2 R117.1
NetQ13_3: Q13.3(C) R29.1
NetQ14_1: Q14.1(B) R39.2 R118.1
NetQ14_3: Q14.3(C) R30.1
NetQ15_1: Q15.1(B) R40.2 R119.1
NetQ15_3: Q15.3(C) R31.1
NetQ16_1: Q16.1(B) R41.2 R120.1
NetQ16_3: Q16.3(C) R32.1
NetQ17_1: Q17.1(B) R42.2 R121.1
NetQ17_3: Q17.3(C) R33.1
NetQ18_1: Q18.1(B) R43.2 R122.1
NetQ18_3: Q18.3(C) R34.1
NetQ19_1: Q19.1(B) R44.2 R123.1
NetQ19_3: Q19.3(C) R35.1
NetQ20_1: Q20.1 R45.2 R54.2
NetQ21_1: Q21.1 R46.2 R55.2
NetQ22_1: Q22.1 R47.2 R56.2
NetQ23_1: Q23.1 R48.2 R57.2
NetQ24_1: Q24.1 R49.2 R58.2
NetQ25_1: Q25.1 R50.2 R59.2
NetQ26_1: Q26.1 R51.2 R60.2
NetQ27_1: Q27.1 R52.2 R61.2
NetQ28_1: Q28.1 R53.2 R62.2
NetQ29_1: Q29.1(B) R63.2 R124.1
NetQ29_3: Q29.3(C) R54.1
NetQ30_1: Q30.1(B) R64.2 R125.1
NetQ30_3: Q30.3(C) R55.1
NetQ31_1: Q31.1(B) R65.2 R126.1
NetQ31_3: Q31.3(C) R56.1
NetQ32_1: Q32.1(B) R66.2 R127.1
NetQ32_3: Q32.3(C) R57.1
NetQ33_1: Q33.1(B) R67.2 R128.1
NetQ33_3: Q33.3(C) R58.1
NetQ34_1: Q34.1(B) R68.2 R129.1
NetQ34_3: Q34.3(C) R59.1
NetQ35_1: Q35.1(B) R69.2 R130.1
NetQ35_3: Q35.3(C) R60.1
NetQ36_1: Q36.1(B) R70.2 R131.1
NetQ36_3: Q36.3(C) R61.1
NetQ37_1: Q37.1(B) R71.2 R132.1
NetQ37_3: Q37.3(C) R62.1
NetQ38_1: Q38.1 R72.2 R81.2
NetQ39_1: Q39.1 R73.2 R82.2
NetQ40_1: Q40.1 R74.2 R83.2
NetQ41_1: Q41.1 R75.2 R84.2
NetQ42_1: Q42.1 R76.2 R85.2
NetQ43_1: Q43.1 R77.2 R86.2
NetQ44_1: Q44.1 R78.2 R87.2
NetQ45_1: Q45.1 R79.2 R88.2
NetQ46_1: Q46.1 R80.2 R89.2
NetQ47_1: Q47.1(B) R90.2 R133.1
NetQ47_3: Q47.3(C) R81.1
NetQ48_1: Q48.1(B) R91.2 R134.1
NetQ48_3: Q48.3(C) R82.1
NetQ49_1: Q49.1(B) R92.2 R135.1
NetQ49_3: Q49.3(C) R83.1
NetQ50_1: Q50.1(B) R93.2 R136.1
NetQ50_3: Q50.3(C) R84.1
NetQ51_1: Q51.1(B) R94.2 R137.1
NetQ51_3: Q51.3(C) R85.1
NetQ52_1: Q52.1(B) R95.2 R138.1
NetQ52_3: Q52.3(C) R86.1
NetQ53_1: Q53.1(B) R96.2 R139.1
NetQ53_3: Q53.3(C) R87.1
NetQ54_1: Q54.1(B) R97.2 R140.1
NetQ54_3: Q54.3(C) R88.1
NetQ55_1: Q55.1(B) R98.2 R141.1
NetQ55_3: Q55.3(C) R89.1
NetQ57_1: Q57.1 R100.2 R106.2
NetQ58_1: Q58.1 R101.2 R107.2
NetQ59_1: Q59.1 R102.2 R108.2
NetQ60_1: Q60.1 R103.2 R109.2
NetQ61_1: Q61.1 R104.2 R110.2
NetQ63_1: Q63.1(B) R112.2 R142.1
NetQ63_3: Q63.3(C) R106.1
NetQ64_1: Q64.1(B) R113.2 R143.1
NetQ64_3: Q64.3(C) R107.1
NetQ65_1: Q65.1(B) R114.2 R144.1
NetQ65_3: Q65.3(C) R108.1
NetQ66_1: Q66.1(B) R115.2 R145.1
NetQ66_3: Q66.3(C) R109.1
NetQ67_1: Q67.1(B) R116.2 R146.1
NetQ67_3: Q67.3(C) R110.1

### Notes on the sheet
- Project:
- BEE-PC1
- Sub-system:
- Design by:
- Hung Nguyen D.
- Bao Bui Q.
- Sheet title:
- Sheet
- A3
- of
- Checked by:
- Approved by:
- Vu Pham
- Revision:
- Document No:
- V1.0.0
- Size:
- Date:

### Library data of the parts
DIO1-DIO32 = Diode SMD: Default Diode; Code - JEDEC: DO-214-AB; Value: 1N5007; Published: 8-Jun-2000; Revision: July-2002: Re-released for DXP Platform.; Publisher: Altium Limited
LD1-LD32 = LD
Q2-Q10 Q20-Q28 Q38-Q46 Q57-Q61 = FET-P
Q11-Q19 Q29-Q37 Q47-Q55 Q63-Q67 = 2SC1815: SOT23-3; Value: C1815
R18-R98 R100-R146 = Res-SMD: as R1 on sheet EFUSE_AND_REGULATOR; Published: 08/06/2000; Publisher: Altium Hobart Technology Centre

## Sheet SWITCHING (CONT).SchDoc
size 420 x 297 mm; SheetNumber: 7; SheetTotal: 7
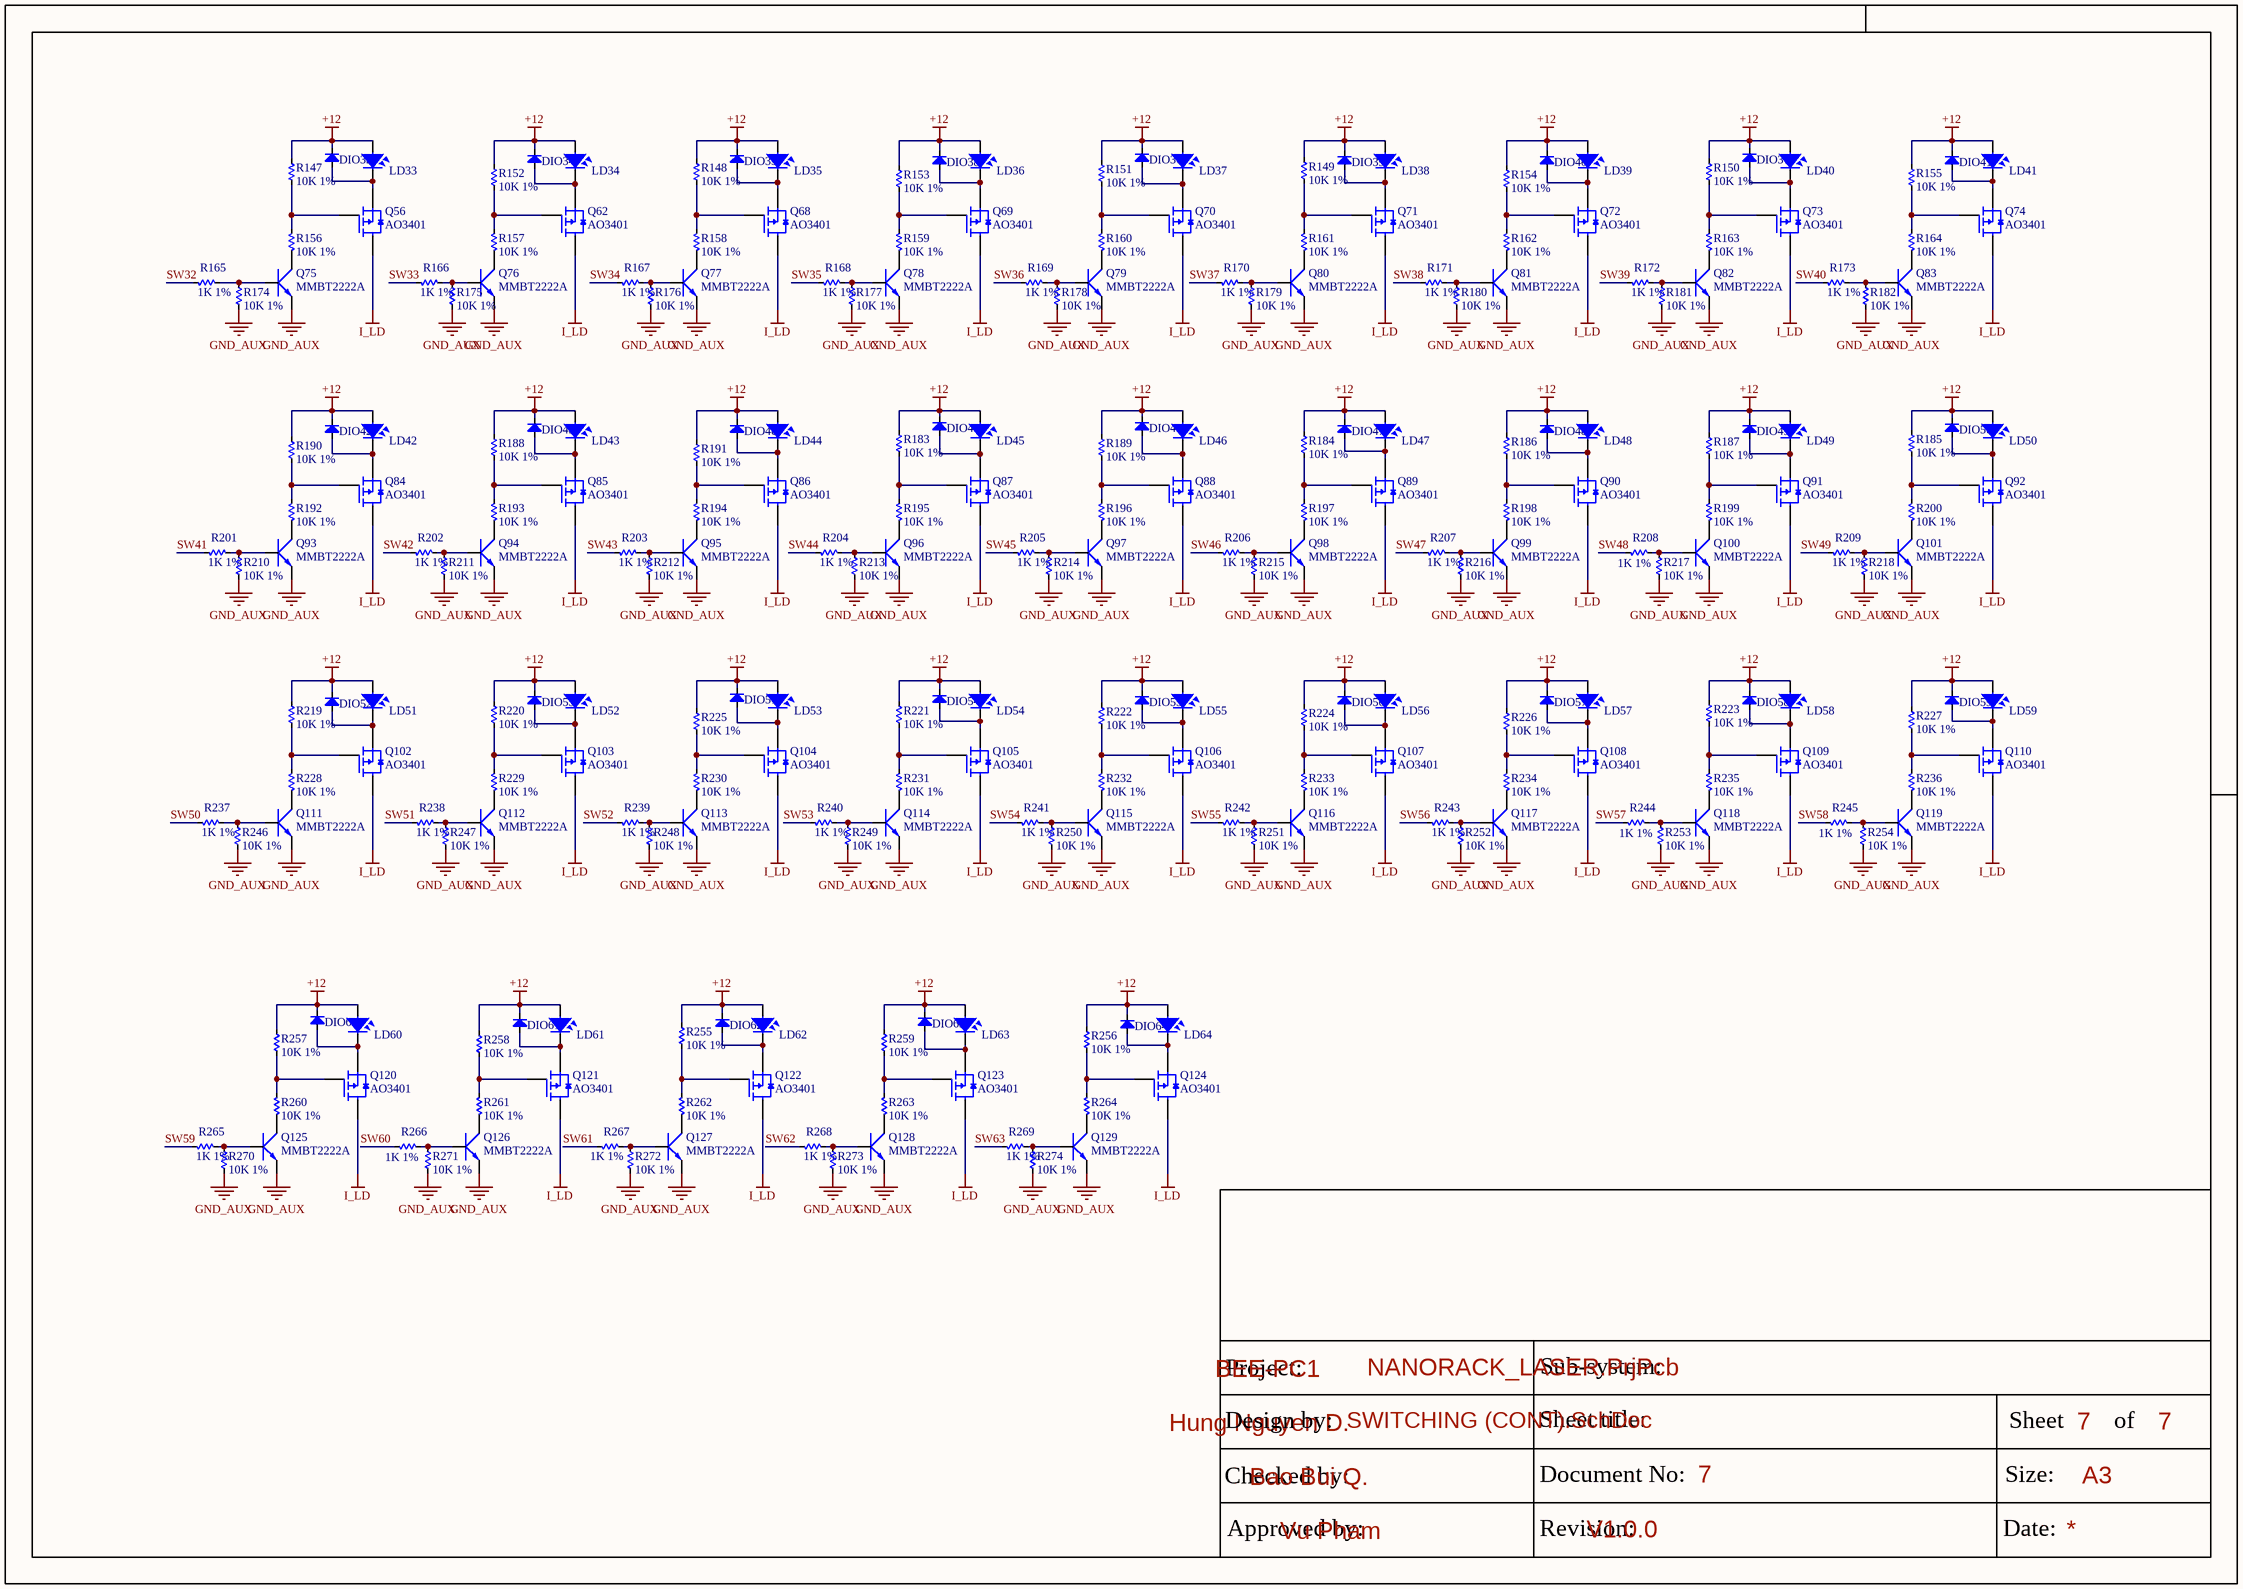
[diagram p6: SWITCHING (CONT).SchDoc]

### Parts
DIO33  Diode SMD  [SOD23]  (value not drawn)
DIO34  Diode SMD  [SOD23]  (value not drawn)
DIO35  Diode SMD  [SOD23]  (value not drawn)
DIO36  Diode SMD  [SOD23]  (value not drawn)
DIO37  Diode SMD  [SOD23]  (value not drawn)
DIO38  Diode SMD  [SOD23]  (value not drawn)
DIO39  Diode SMD  [SOD23]  (value not drawn)
DIO40  Diode SMD  [SOD23]  (value not drawn)
DIO41  Diode SMD  [SOD23]  (value not drawn)
DIO42  Diode SMD  [SOD23]  (value not drawn)
DIO43  Diode SMD  [SOD23]  (value not drawn)
DIO44  Diode SMD  [SOD23]  (value not drawn)
DIO45  Diode SMD  [SOD23]  (value not drawn)
DIO46  Diode SMD  [SOD23]  (value not drawn)
DIO47  Diode SMD  [SOD23]  (value not drawn)
DIO48  Diode SMD  [SOD23]  (value not drawn)
DIO49  Diode SMD  [SOD23]  (value not drawn)
DIO50  Diode SMD  [SOD23]  (value not drawn)
DIO51  Diode SMD  [SOD23]  (value not drawn)
DIO52  Diode SMD  [SOD23]  (value not drawn)
DIO53  Diode SMD  [SOD23]  (value not drawn)
DIO54  Diode SMD  [SOD23]  (value not drawn)
DIO55  Diode SMD  [SOD23]  (value not drawn)
DIO56  Diode SMD  [SOD23]  (value not drawn)
DIO57  Diode SMD  [SOD23]  (value not drawn)
DIO58  Diode SMD  [SOD23]  (value not drawn)
DIO59  Diode SMD  [SOD23]  (value not drawn)
DIO60  Diode SMD  [SOD23]  (value not drawn)
DIO61  Diode SMD  [SOD23]  (value not drawn)
DIO62  Diode SMD  [SOD23]  (value not drawn)
DIO63  Diode SMD  [SOD23]  (value not drawn)
DIO64  Diode SMD  [SOD23]  (value not drawn)
LD33  LaserDiode  [LASER]  (value not drawn)
LD34  LaserDiode  [LASER]  (value not drawn)
LD35  LaserDiode  [LASER]  (value not drawn)
LD36  LaserDiode  [LASER]  (value not drawn)
LD37  LaserDiode  [LASER]  (value not drawn)
LD38  LaserDiode  [LASER]  (value not drawn)
LD39  LaserDiode  [LASER]  (value not drawn)
LD40  LaserDiode  [LASER]  (value not drawn)
LD41  LaserDiode  [LASER]  (value not drawn)
LD42  LaserDiode  [LASER]  (value not drawn)
LD43  LaserDiode  [LASER]  (value not drawn)
LD44  LaserDiode  [LASER]  (value not drawn)
LD45  LaserDiode  [LASER]  (value not drawn)
LD46  LaserDiode  [LASER]  (value not drawn)
LD47  LaserDiode  [LASER]  (value not drawn)
LD48  LaserDiode  [LASER]  (value not drawn)
LD49  LaserDiode  [LASER]  (value not drawn)
LD50  LaserDiode  [LASER]  (value not drawn)
LD51  LaserDiode  [LASER]  (value not drawn)
LD52  LaserDiode  [LASER]  (value not drawn)
LD53  LaserDiode  [LASER]  (value not drawn)
LD54  LaserDiode  [LASER]  (value not drawn)
LD55  LaserDiode  [LASER]  (value not drawn)
LD56  LaserDiode  [LASER]  (value not drawn)
LD57  LaserDiode  [LASER]  (value not drawn)
LD58  LaserDiode  [LASER]  (value not drawn)
LD59  LaserDiode  [LASER]  (value not drawn)
LD60  LaserDiode  [LASER]  (value not drawn)
LD61  LaserDiode  [LASER]  (value not drawn)
LD62  LaserDiode  [LASER]  (value not drawn)
LD63  LaserDiode  [LASER]  (value not drawn)
LD64  LaserDiode  [LASER]  (value not drawn)
Q56  AO3401  [SOT23-123]
Q62  AO3401  [SOT23-123]
Q68  AO3401  [SOT23-123]
Q69  AO3401  [SOT23-123]
Q70  AO3401  [SOT23-123]
Q71  AO3401  [SOT23-123]
Q72  AO3401  [SOT23-123]
Q73  AO3401  [SOT23-123]
Q74  AO3401  [SOT23-123]
Q75  MMBT2222A  [SOT23-132]
Q76  MMBT2222A  [SOT23-132]
Q77  MMBT2222A  [SOT23-132]
Q78  MMBT2222A  [SOT23-132]
Q79  MMBT2222A  [SOT23-132]
Q80  MMBT2222A  [SOT23-132]
Q81  MMBT2222A  [SOT23-132]
Q82  MMBT2222A  [SOT23-132]
Q83  MMBT2222A  [SOT23-132]
Q84  AO3401  [SOT23-123]
Q85  AO3401  [SOT23-123]
Q86  AO3401  [SOT23-123]
Q87  AO3401  [SOT23-123]
Q88  AO3401  [SOT23-123]
Q89  AO3401  [SOT23-123]
Q90  AO3401  [SOT23-123]
Q91  AO3401  [SOT23-123]
Q92  AO3401  [SOT23-123]
Q93  MMBT2222A  [SOT23-132]
Q94  MMBT2222A  [SOT23-132]
Q95  MMBT2222A  [SOT23-132]
Q96  MMBT2222A  [SOT23-132]
Q97  MMBT2222A  [SOT23-132]
Q98  MMBT2222A  [SOT23-132]
Q99  MMBT2222A  [SOT23-132]
Q100  MMBT2222A  [SOT23-132]
Q101  MMBT2222A  [SOT23-132]
Q102  AO3401  [SOT23-123]
Q103  AO3401  [SOT23-123]
Q104  AO3401  [SOT23-123]
Q105  AO3401  [SOT23-123]
Q106  AO3401  [SOT23-123]
Q107  AO3401  [SOT23-123]
Q108  AO3401  [SOT23-123]
Q109  AO3401  [SOT23-123]
Q110  AO3401  [SOT23-123]
Q111  MMBT2222A  [SOT23-132]
Q112  MMBT2222A  [SOT23-132]
Q113  MMBT2222A  [SOT23-132]
Q114  MMBT2222A  [SOT23-132]
Q115  MMBT2222A  [SOT23-132]
Q116  MMBT2222A  [SOT23-132]
Q117  MMBT2222A  [SOT23-132]
Q118  MMBT2222A  [SOT23-132]
Q119  MMBT2222A  [SOT23-132]
Q120  AO3401  [SOT23-123]
Q121  AO3401  [SOT23-123]
Q122  AO3401  [SOT23-123]
Q123  AO3401  [SOT23-123]
Q124  AO3401  [SOT23-123]
Q125  MMBT2222A  [SOT23-132]
Q126  MMBT2222A  [SOT23-132]
Q127  MMBT2222A  [SOT23-132]
Q128  MMBT2222A  [SOT23-132]
Q129  MMBT2222A  [SOT23-132]
R147  10K 1%  [RES-SMD-0603]
R148  10K 1%  [RES-SMD-0603]
R149  10K 1%  [RES-SMD-0603]
R150  10K 1%  [RES-SMD-0603]
R151  10K 1%  [RES-SMD-0603]
R152  10K 1%  [RES-SMD-0603]
R153  10K 1%  [RES-SMD-0603]
R154  10K 1%  [RES-SMD-0603]
R155  10K 1%  [RES-SMD-0603]
R156  10K 1%  [RES-SMD-0603]
R157  10K 1%  [RES-SMD-0603]
R158  10K 1%  [RES-SMD-0603]
R159  10K 1%  [RES-SMD-0603]
R160  10K 1%  [RES-SMD-0603]
R161  10K 1%  [RES-SMD-0603]
R162  10K 1%  [RES-SMD-0603]
R163  10K 1%  [RES-SMD-0603]
R164  10K 1%  [RES-SMD-0603]
R165  1K 1%  [RES-SMD-0603]
R166  1K 1%  [RES-SMD-0603]
R167  1K 1%  [RES-SMD-0603]
R168  1K 1%  [RES-SMD-0603]
R169  1K 1%  [RES-SMD-0603]
R170  1K 1%  [RES-SMD-0603]
R171  1K 1%  [RES-SMD-0603]
R172  1K 1%  [RES-SMD-0603]
R173  1K 1%  [RES-SMD-0603]
R174  10K 1%  [RES-SMD-0603]
R175  10K 1%  [RES-SMD-0603]
R176  10K 1%  [RES-SMD-0603]
R177  10K 1%  [RES-SMD-0603]
R178  10K 1%  [RES-SMD-0603]
R179  10K 1%  [RES-SMD-0603]
R180  10K 1%  [RES-SMD-0603]
R181  10K 1%  [RES-SMD-0603]
R182  10K 1%  [RES-SMD-0603]
R183  10K 1%  [RES-SMD-0603]
R184  10K 1%  [RES-SMD-0603]
R185  10K 1%  [RES-SMD-0603]
R186  10K 1%  [RES-SMD-0603]
R187  10K 1%  [RES-SMD-0603]
R188  10K 1%  [RES-SMD-0603]
R189  10K 1%  [RES-SMD-0603]
R190  10K 1%  [RES-SMD-0603]
R191  10K 1%  [RES-SMD-0603]
R192  10K 1%  [RES-SMD-0603]
R193  10K 1%  [RES-SMD-0603]
R194  10K 1%  [RES-SMD-0603]
R195  10K 1%  [RES-SMD-0603]
R196  10K 1%  [RES-SMD-0603]
R197  10K 1%  [RES-SMD-0603]
R198  10K 1%  [RES-SMD-0603]
R199  10K 1%  [RES-SMD-0603]
R200  10K 1%  [RES-SMD-0603]
R201  1K 1%  [RES-SMD-0603]
R202  1K 1%  [RES-SMD-0603]
R203  1K 1%  [RES-SMD-0603]
R204  1K 1%  [RES-SMD-0603]
R205  1K 1%  [RES-SMD-0603]
R206  1K 1%  [RES-SMD-0603]
R207  1K 1%  [RES-SMD-0603]
R208  1K 1%  [RES-SMD-0603]
R209  1K 1%  [RES-SMD-0603]
R210  10K 1%  [RES-SMD-0603]
R211  10K 1%  [RES-SMD-0603]
R212  10K 1%  [RES-SMD-0603]
R213  10K 1%  [RES-SMD-0603]
R214  10K 1%  [RES-SMD-0603]
R215  10K 1%  [RES-SMD-0603]
R216  10K 1%  [RES-SMD-0603]
R217  10K 1%  [RES-SMD-0603]
R218  10K 1%  [RES-SMD-0603]
R219  10K 1%  [RES-SMD-0603]
R220  10K 1%  [RES-SMD-0603]
R221  10K 1%  [RES-SMD-0603]
R222  10K 1%  [RES-SMD-0603]
R223  10K 1%  [RES-SMD-0603]
R224  10K 1%  [RES-SMD-0603]
R225  10K 1%  [RES-SMD-0603]
R226  10K 1%  [RES-SMD-0603]
R227  10K 1%  [RES-SMD-0603]
R228  10K 1%  [RES-SMD-0603]
R229  10K 1%  [RES-SMD-0603]
R230  10K 1%  [RES-SMD-0603]
R231  10K 1%  [RES-SMD-0603]
R232  10K 1%  [RES-SMD-0603]
R233  10K 1%  [RES-SMD-0603]
R234  10K 1%  [RES-SMD-0603]
R235  10K 1%  [RES-SMD-0603]
R236  10K 1%  [RES-SMD-0603]
R237  1K 1%  [RES-SMD-0603]
R238  1K 1%  [RES-SMD-0603]
R239  1K 1%  [RES-SMD-0603]
R240  1K 1%  [RES-SMD-0603]
R241  1K 1%  [RES-SMD-0603]
R242  1K 1%  [RES-SMD-0603]
R243  1K 1%  [RES-SMD-0603]
R244  1K 1%  [RES-SMD-0603]
R245  1K 1%  [RES-SMD-0603]
R246  10K 1%  [RES-SMD-0603]
R247  10K 1%  [RES-SMD-0603]
R248  10K 1%  [RES-SMD-0603]
R249  10K 1%  [RES-SMD-0603]
R250  10K 1%  [RES-SMD-0603]
R251  10K 1%  [RES-SMD-0603]
R252  10K 1%  [RES-SMD-0603]
R253  10K 1%  [RES-SMD-0603]
R254  10K 1%  [RES-SMD-0603]
R255  10K 1%  [RES-SMD-0603]
R256  10K 1%  [RES-SMD-0603]
R257  10K 1%  [RES-SMD-0603]
R258  10K 1%  [RES-SMD-0603]
R259  10K 1%  [RES-SMD-0603]
R260  10K 1%  [RES-SMD-0603]
R261  10K 1%  [RES-SMD-0603]
R262  10K 1%  [RES-SMD-0603]
R263  10K 1%  [RES-SMD-0603]
R264  10K 1%  [RES-SMD-0603]
R265  1K 1%  [RES-SMD-0603]
R266  1K 1%  [RES-SMD-0603]
R267  1K 1%  [RES-SMD-0603]
R268  1K 1%  [RES-SMD-0603]
R269  1K 1%  [RES-SMD-0603]
R270  10K 1%  [RES-SMD-0603]
R271  10K 1%  [RES-SMD-0603]
R272  10K 1%  [RES-SMD-0603]
R273  10K 1%  [RES-SMD-0603]
R274  10K 1%  [RES-SMD-0603]

### Nets
+12: DIO33.2(K) DIO34.2(K) DIO35.2(K) DIO36.2(K) DIO37.2(K) DIO38.2(K) DIO39.2(K) DIO40.2(K) DIO41.2(K) DIO42.2(K) DIO43.2(K) DIO44.2(K) DIO45.2(K) DIO46.2(K) DIO47.2(K) DIO48.2(K) DIO49.2(K) DIO50.2(K) DIO51.2(K) DIO52.2(K) DIO53.2(K) DIO54.2(K) DIO55.2(K) DIO56.2(K) DIO57.2(K) DIO58.2(K) DIO59.2(K) DIO60.2(K) DIO61.2(K) DIO62.2(K) DIO63.2(K) DIO64.2(K) LD33.1 LD34.1 LD35.1 LD36.1 LD37.1 LD38.1 LD39.1 LD40.1 LD41.1 LD42.1 LD43.1 LD44.1 LD45.1 LD46.1 LD47.1 LD48.1 LD49.1 LD50.1 LD51.1 LD52.1 LD53.1 LD54.1 LD55.1 LD56.1 LD57.1 LD58.1 LD59.1 LD60.1 LD61.1 LD62.1 LD63.1 LD64.1 R147.1 R148.1 R149.1 R150.1 R151.1 R152.1 R153.1 R154.1 R155.1 R183.1 R184.1 R185.1 R186.1 R187.1 R188.1 R189.1 R190.1 R191.1 R219.1 R220.1 R221.1 R222.1 R223.1 R224.1 R225.1 R226.1 R227.1 R255.1 R256.1 R257.1 R258.1 R259.1
GND_AUX: Q75.2(E) Q76.2(E) Q77.2(E) Q78.2(E) Q79.2(E) Q80.2(E) Q81.2(E) Q82.2(E) Q83.2(E) Q93.2(E) Q94.2(E) Q95.2(E) Q96.2(E) Q97.2(E) Q98.2(E) Q99.2(E) Q100.2(E) Q101.2(E) Q111.2(E) Q112.2(E) Q113.2(E) Q114.2(E) Q115.2(E) Q116.2(E) Q117.2(E) Q118.2(E) Q119.2(E) Q125.2(E) Q126.2(E) Q127.2(E) Q128.2(E) Q129.2(E) R174.2 R175.2 R176.2 R177.2 R178.2 R179.2 R180.2 R181.2 R182.2 R210.2 R211.2 R212.2 R213.2 R214.2 R215.2 R216.2 R217.2 R218.2 R246.2 R247.2 R248.2 R249.2 R250.2 R251.2 R252.2 R253.2 R254.2 R270.2 R271.2 R272.2 R273.2 R274.2
I_LD: Q56.2 Q62.2 Q68.2 Q69.2 Q70.2 Q71.2 Q72.2 Q73.2 Q74.2 Q84.2 Q85.2 Q86.2 Q87.2 Q88.2 Q89.2 Q90.2 Q91.2 Q92.2 Q102.2 Q103.2 Q104.2 Q105.2 Q106.2 Q107.2 Q108.2 Q109.2 Q110.2 Q120.2 Q121.2 Q122.2 Q123.2 Q124.2
SW32: R165.1
SW33: R166.1
SW34: R167.1
SW35: R168.1
SW36: R169.1
SW37: R170.1
SW38: R171.1
SW39: R172.1
SW40: R173.1
SW41: R201.1
SW42: R202.1
SW43: R203.1
SW44: R204.1
SW45: R205.1
SW46: R206.1
SW47: R207.1
SW48: R208.1
SW49: R209.1
SW50: R237.1
SW51: R238.1
SW52: R239.1
SW53: R240.1
SW54: R241.1
SW55: R242.1
SW56: R243.1
SW57: R244.1
SW58: R245.1
SW59: R265.1
SW60: R266.1
SW61: R267.1
SW62: R268.1
SW63: R269.1
NetDIO33_1: DIO33.1(A) LD33.3 Q56.3
NetDIO34_1: DIO34.1(A) LD34.3 Q62.3
NetDIO35_1: DIO35.1(A) LD35.3 Q68.3
NetDIO36_1: DIO36.1(A) LD37.3 Q70.3
NetDIO37_1: DIO37.1(A) LD40.3 Q73.3
NetDIO38_1: DIO38.1(A) LD36.3 Q69.3
NetDIO39_1: DIO39.1(A) LD38.3 Q71.3
NetDIO40_1: DIO40.1(A) LD39.3 Q72.3
NetDIO41_1: DIO41.1(A) LD41.3 Q74.3
NetDIO42_1: DIO42.1(A) LD42.3 Q84.3
NetDIO43_1: DIO43.1(A) LD43.3 Q85.3
NetDIO44_1: DIO44.1(A) LD45.3 Q87.3
NetDIO45_1: DIO45.1(A) LD46.3 Q88.3
NetDIO46_1: DIO46.1(A) LD44.3 Q86.3
NetDIO47_1: DIO47.1(A) LD47.3 Q89.3
NetDIO48_1: DIO48.1(A) LD48.3 Q90.3
NetDIO49_1: DIO49.1(A) LD49.3 Q91.3
NetDIO50_1: DIO50.1(A) LD50.3 Q92.3
NetDIO51_1: DIO51.1(A) LD53.3 Q104.3
NetDIO52_1: DIO52.1(A) LD51.3 Q102.3
NetDIO53_1: DIO53.1(A) LD52.3 Q103.3
NetDIO54_1: DIO54.1(A) LD54.3 Q105.3
NetDIO55_1: DIO55.1(A) LD55.3 Q106.3
NetDIO56_1: DIO56.1(A) LD56.3 Q107.3
NetDIO57_1: DIO57.1(A) LD57.3 Q108.3
NetDIO58_1: DIO58.1(A) LD58.3 Q109.3
NetDIO59_1: DIO59.1(A) LD59.3 Q110.3
NetDIO60_1: DIO60.1(A) LD60.3 Q120.3
NetDIO61_1: DIO61.1(A) LD61.3 Q121.3
NetDIO62_1: DIO62.1(A) LD62.3 Q122.3
NetDIO63_1: DIO63.1(A) LD63.3 Q123.3
NetDIO64_1: DIO64.1(A) LD64.3 Q124.3
NetQ56_1: Q56.1 R147.2 R156.2
NetQ62_1: Q62.1 R152.2 R157.2
NetQ68_1: Q68.1 R148.2 R158.2
NetQ69_1: Q69.1 R153.2 R159.2
NetQ70_1: Q70.1 R151.2 R160.2
NetQ71_1: Q71.1 R149.2 R161.2
NetQ72_1: Q72.1 R154.2 R162.2
NetQ73_1: Q73.1 R150.2 R163.2
NetQ74_1: Q74.1 R155.2 R164.2
NetQ75_1: Q75.1(B) R165.2 R174.1
NetQ75_3: Q75.3(C) R156.1
NetQ76_1: Q76.1(B) R166.2 R175.1
NetQ76_3: Q76.3(C) R157.1
NetQ77_1: Q77.1(B) R167.2 R176.1
NetQ77_3: Q77.3(C) R158.1
NetQ78_1: Q78.1(B) R168.2 R177.1
NetQ78_3: Q78.3(C) R159.1
NetQ79_1: Q79.1(B) R169.2 R178.1
NetQ79_3: Q79.3(C) R160.1
NetQ80_1: Q80.1(B) R170.2 R179.1
NetQ80_3: Q80.3(C) R161.1
NetQ81_1: Q81.1(B) R171.2 R180.1
NetQ81_3: Q81.3(C) R162.1
NetQ82_1: Q82.1(B) R172.2 R181.1
NetQ82_3: Q82.3(C) R163.1
NetQ83_1: Q83.1(B) R173.2 R182.1
NetQ83_3: Q83.3(C) R164.1
NetQ84_1: Q84.1 R190.2 R192.2
NetQ85_1: Q85.1 R188.2 R193.2
NetQ86_1: Q86.1 R191.2 R194.2
NetQ87_1: Q87.1 R183.2 R195.2
NetQ88_1: Q88.1 R189.2 R196.2
NetQ89_1: Q89.1 R184.2 R197.2
NetQ90_1: Q90.1 R186.2 R198.2
NetQ91_1: Q91.1 R187.2 R199.2
NetQ92_1: Q92.1 R185.2 R200.2
NetQ93_1: Q93.1(B) R201.2 R210.1
NetQ93_3: Q93.3(C) R192.1
NetQ94_1: Q94.1(B) R202.2 R211.1
NetQ94_3: Q94.3(C) R193.1
NetQ95_1: Q95.1(B) R203.2 R212.1
NetQ95_3: Q95.3(C) R194.1
NetQ96_1: Q96.1(B) R204.2 R213.1
NetQ96_3: Q96.3(C) R195.1
NetQ97_1: Q97.1(B) R205.2 R214.1
NetQ97_3: Q97.3(C) R196.1
NetQ98_1: Q98.1(B) R206.2 R215.1
NetQ98_3: Q98.3(C) R197.1
NetQ99_1: Q99.1(B) R207.2 R216.1
NetQ99_3: Q99.3(C) R198.1
NetQ100_1: Q100.1(B) R208.2 R217.1
NetQ100_3: Q100.3(C) R199.1
NetQ101_1: Q101.1(B) R209.2 R218.1
NetQ101_3: Q101.3(C) R200.1
NetQ102_1: Q102.1 R219.2 R228.2
NetQ103_1: Q103.1 R220.2 R229.2
NetQ104_1: Q104.1 R225.2 R230.2
NetQ105_1: Q105.1 R221.2 R231.2
NetQ106_1: Q106.1 R222.2 R232.2
NetQ107_1: Q107.1 R224.2 R233.2
NetQ108_1: Q108.1 R226.2 R234.2
NetQ109_1: Q109.1 R223.2 R235.2
NetQ110_1: Q110.1 R227.2 R236.2
NetQ111_1: Q111.1(B) R237.2 R246.1
NetQ111_3: Q111.3(C) R228.1
NetQ112_1: Q112.1(B) R238.2 R247.1
NetQ112_3: Q112.3(C) R229.1
NetQ113_1: Q113.1(B) R239.2 R248.1
NetQ113_3: Q113.3(C) R230.1
NetQ114_1: Q114.1(B) R240.2 R249.1
NetQ114_3: Q114.3(C) R231.1
NetQ115_1: Q115.1(B) R241.2 R250.1
NetQ115_3: Q115.3(C) R232.1
NetQ116_1: Q116.1(B) R242.2 R251.1
NetQ116_3: Q116.3(C) R233.1
NetQ117_1: Q117.1(B) R243.2 R252.1
NetQ117_3: Q117.3(C) R234.1
NetQ118_1: Q118.1(B) R244.2 R253.1
NetQ118_3: Q118.3(C) R235.1
NetQ119_1: Q119.1(B) R245.2 R254.1
NetQ119_3: Q119.3(C) R236.1
NetQ120_1: Q120.1 R257.2 R260.2
NetQ121_1: Q121.1 R258.2 R261.2
NetQ122_1: Q122.1 R255.2 R262.2
NetQ123_1: Q123.1 R259.2 R263.2
NetQ124_1: Q124.1 R256.2 R264.2
NetQ125_1: Q125.1(B) R265.2 R270.1
NetQ125_3: Q125.3(C) R260.1
NetQ126_1: Q126.1(B) R266.2 R271.1
NetQ126_3: Q126.3(C) R261.1
NetQ127_1: Q127.1(B) R267.2 R272.1
NetQ127_3: Q127.3(C) R262.1
NetQ128_1: Q128.1(B) R268.2 R273.1
NetQ128_3: Q128.3(C) R263.1
NetQ129_1: Q129.1(B) R269.2 R274.1
NetQ129_3: Q129.3(C) R264.1

### Notes on the sheet
- Project:
- BEE-PC1
- Sub-system:
- Design by:
- Hung Nguyen D.
- Bao Bui Q.
- Sheet title:
- Sheet
- A3
- of
- Checked by:
- Approved by:
- Vu Pham
- Revision:
- Document No:
- V1.0.0
- Size:
- Date:

### Library data of the parts
DIO33-DIO64 = Diode SMD: as DIO1 on sheet SWITCHING; Published: 8-Jun-2000; Revision: July-2002: Re-released for DXP Platform.; Publisher: Altium Limited
LD33-LD64 = LD
Q56 Q62 Q68-Q74 Q84-Q92 Q102-Q110 Q120-Q124 = FET-P
Q75-Q83 Q93-Q101 Q111-Q119 Q125-Q129 = 2SC1815: SOT23-3; Value: C1815
R147-R274 = Res-SMD: as R1 on sheet EFUSE_AND_REGULATOR; Published: 08/06/2000; Publisher: Altium Hobart Technology Centre

## Nets that join several sheets
+5: EFUSE_AND_REGULATOR (6 pins), COMMUNICATION (29 pins), CURRENT_SOURCE (C33.2 IC4.8)
+12: EFUSE_AND_REGULATOR (7 pins), SWITCHING (96 pins), SWITCHING (CONT) (96 pins)
+12_AUX: EFUSE_AND_REGULATOR (C1.2 IC1.5 R1.2), COMMUNICATION (5 pins)
GND_AUX: EFUSE_AND_REGULATOR (18 pins), COMMUNICATION (33 pins), CURRENT_SOURCE (5 pins), SWITCHING (64 pins), SWITCHING (CONT) (64 pins)
I_LD: CURRENT_SOURCE (Q1.3), SWITCHING (32 pins), SWITCHING (CONT) (32 pins)
CURRENT_MONITOR: COMMUNICATION (R277.2), CURRENT_SOURCE (C39.2 R16.2)
DAC: COMMUNICATION (U2.4 U7.6), CURRENT_SOURCE (R99.1)
SW0: COMMUNICATION (U4.21), SWITCHING (R36.1)
SW1: COMMUNICATION (U4.22), SWITCHING (R37.1)
SW2: COMMUNICATION (U4.23), SWITCHING (R38.1)
SW3: COMMUNICATION (U4.24), SWITCHING (R39.1)
SW4: COMMUNICATION (U4.25), SWITCHING (R40.1)
SW5: COMMUNICATION (U4.26), SWITCHING (R41.1)
SW6: COMMUNICATION (U4.27), SWITCHING (R42.1)
SW7: COMMUNICATION (U4.28), SWITCHING (R43.1)
SW8: COMMUNICATION (U4.1), SWITCHING (R44.1)
SW9: COMMUNICATION (U4.2), SWITCHING (R71.1)
SW10: COMMUNICATION (U4.3), SWITCHING (R70.1)
SW11: COMMUNICATION (U4.4), SWITCHING (R69.1)
SW12: COMMUNICATION (U4.5), SWITCHING (R68.1)
SW13: COMMUNICATION (U4.6), SWITCHING (R67.1)
SW14: COMMUNICATION (U4.7), SWITCHING (R66.1)
SW15: COMMUNICATION (U4.8), SWITCHING (R65.1)
SW16: COMMUNICATION (U5.21), SWITCHING (R64.1)
SW17: COMMUNICATION (U3.21 U5.22 U6.21), SWITCHING (R63.1)
SW18: COMMUNICATION (U3.22 U5.23 U6.22), SWITCHING (R90.1)
SW19: COMMUNICATION (U3.23 U5.24 U6.23), SWITCHING (R91.1)
SW20: COMMUNICATION (U3.24 U5.25 U6.24), SWITCHING (R92.1)
SW21: COMMUNICATION (U3.25 U5.26 U6.25), SWITCHING (R93.1)
SW22: COMMUNICATION (U3.26 U5.27 U6.26), SWITCHING (R94.1)
SW23: COMMUNICATION (U3.27 U5.28 U6.27), SWITCHING (R95.1)
SW24: COMMUNICATION (U3.28 U5.1 U6.28), SWITCHING (R96.1)
SW25: COMMUNICATION (U3.1 U5.2 U6.1), SWITCHING (R97.1)
SW26: COMMUNICATION (U3.2 U5.3 U6.2), SWITCHING (R98.1)
SW27: COMMUNICATION (U3.3 U5.4 U6.3), SWITCHING (R116.1)
SW28: COMMUNICATION (U3.4 U5.5 U6.4), SWITCHING (R115.1)
SW29: COMMUNICATION (U3.5 U5.6 U6.5), SWITCHING (R114.1)
SW30: COMMUNICATION (U3.6 U5.7 U6.6), SWITCHING (R113.1)
SW31: COMMUNICATION (U3.7 U5.8 U6.7), SWITCHING (R112.1)
SW32: COMMUNICATION (U3.8 U6.8), SWITCHING (CONT) (R165.1)